# EAGLE design range_cape (EAGLE 7.1.0)

## Sheet 1 of 5
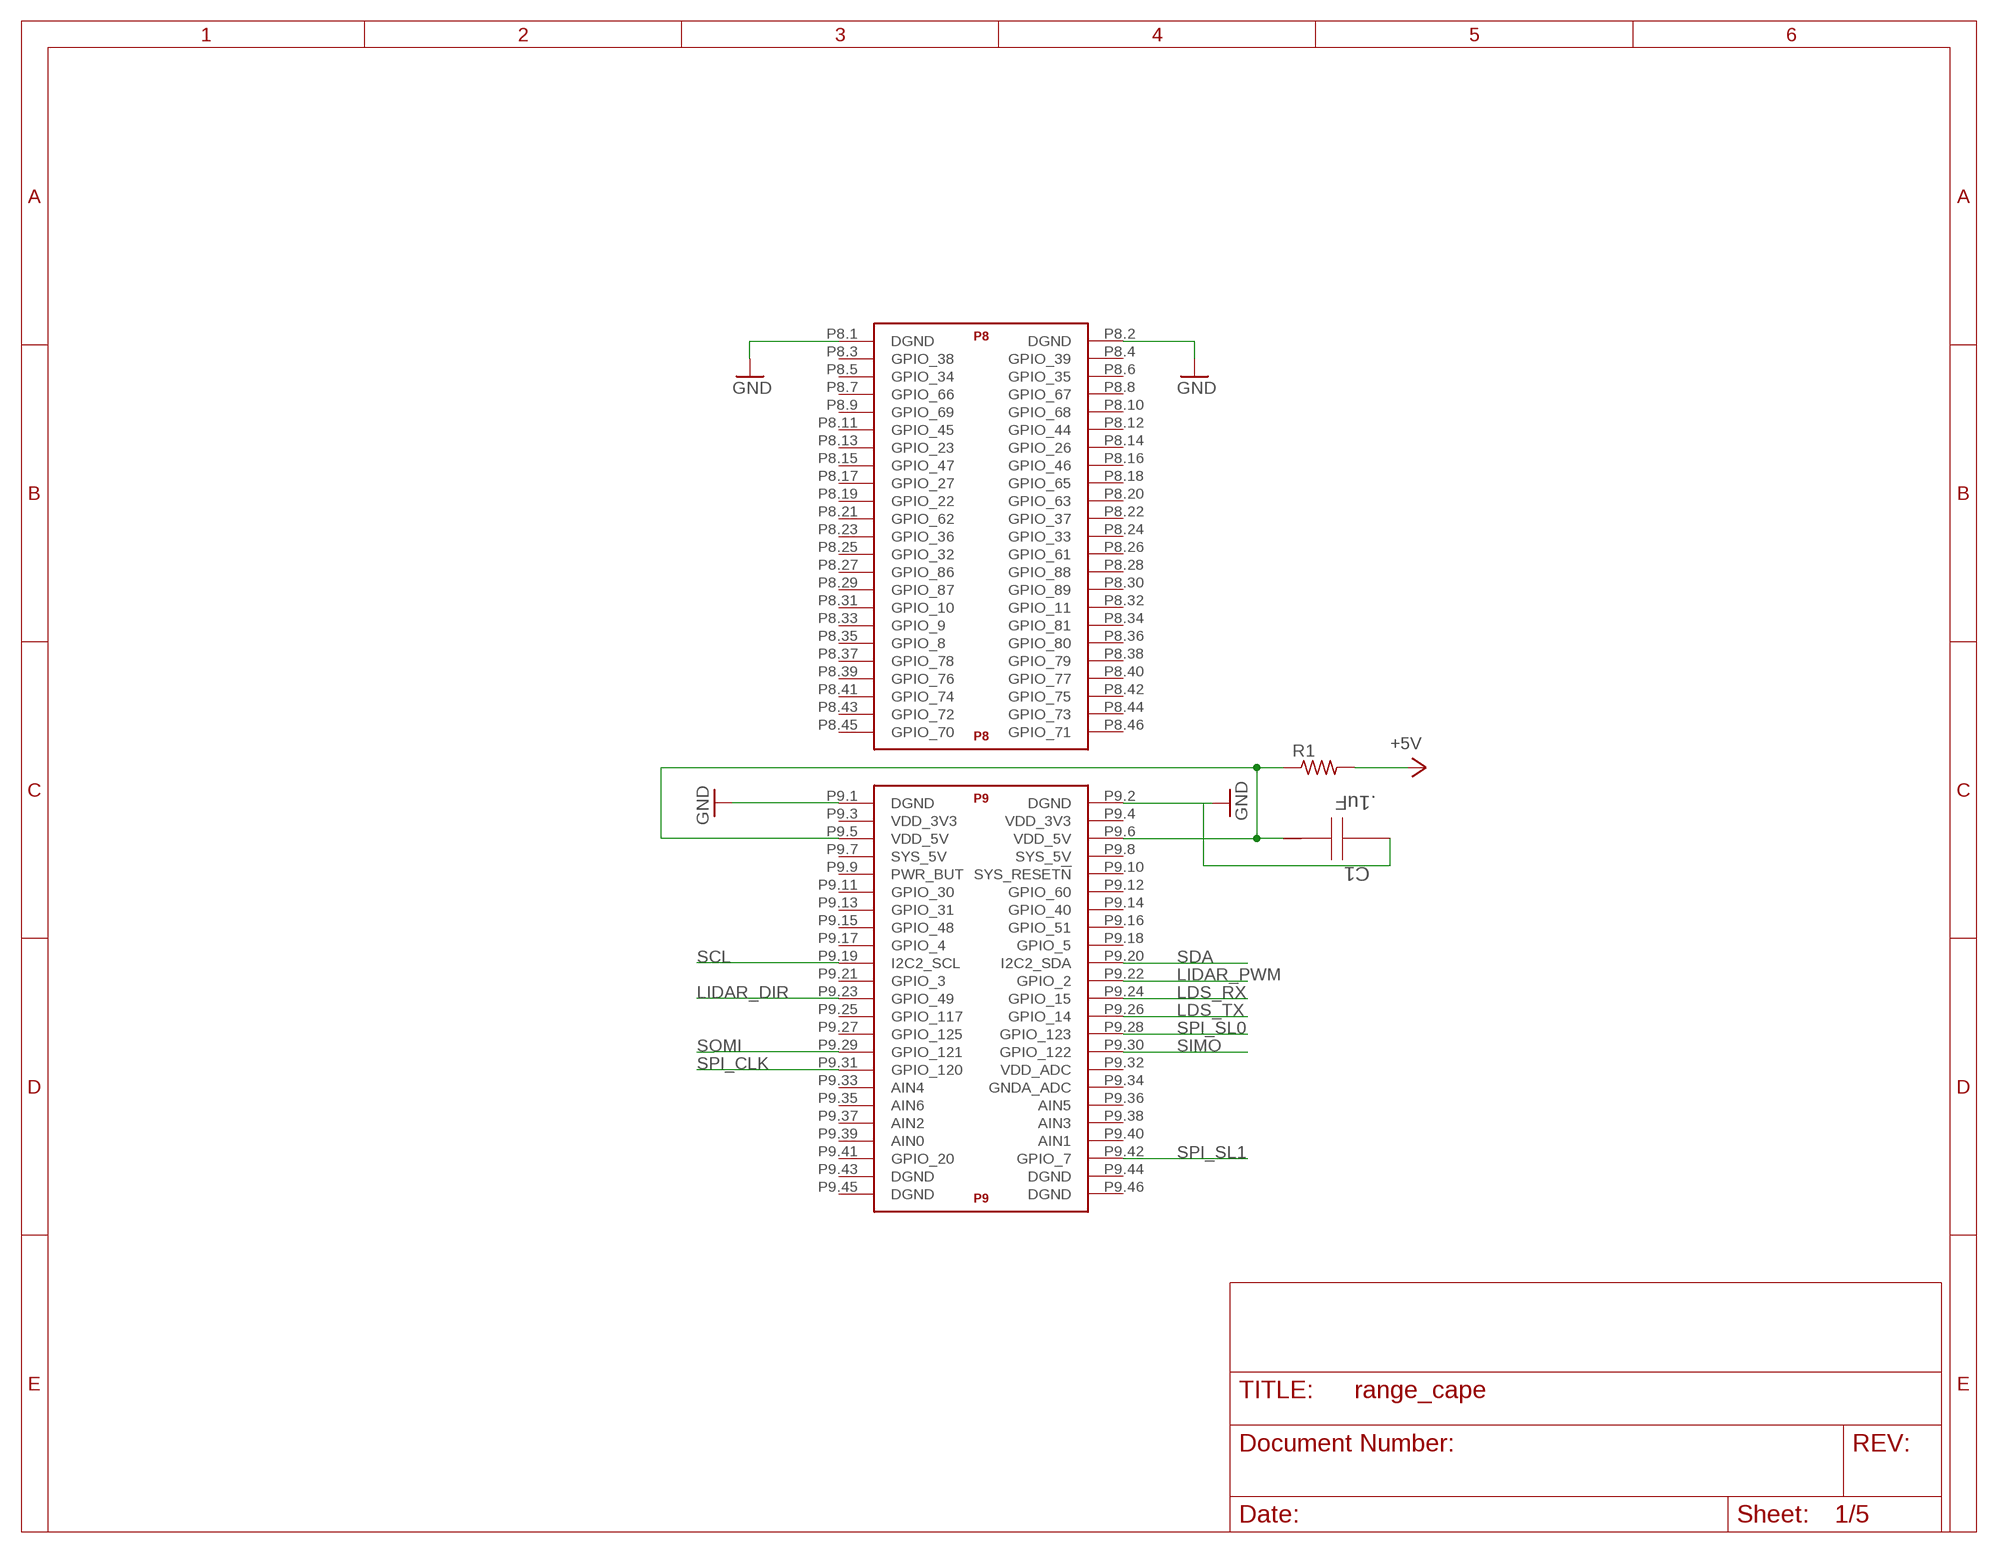
[diagram p0: schematic, sheet 1]

### Parts
C1  .1uF  C3216X5R1A106K  [1206]
R1  R-US_R1206  [R1206]
U$1  BEAGLE_BONE_BLACK_CAPE  [BEAGLE_BONE_BLACK_CAPE]

### Nets
+5V: R1.2 ; also sheet 2,3,4
GND: C1.2 U$1.P8.1(P8:DGND) U$1.P8.2(P8:DGND) U$1.P9.1(P9:DGND) U$1.P9.2(P9:DGND) ; also sheet 2,3,4,5
LDS_RX: U$1.P9.24(P9:GPIO_15) ; also sheet 3
LDS_TX: U$1.P9.26(P9:GPIO_14) ; also sheet 3
LIDAR_DIR: U$1.P9.23(P9:GPIO_49) ; also sheet 2
LIDAR_PWM: U$1.P9.22(P9:GPIO_2) ; also sheet 2
N$1: C1.1 R1.1 U$1.P9.5(P9:VDD_5V) U$1.P9.6(P9:VDD_5V)
SCL: U$1.P9.19(P9:I2C2_SCL) ; also sheet 3
SDA: U$1.P9.20(P9:I2C2_SDA) ; also sheet 3
SIMO: U$1.P9.30(P9:GPIO_122) ; also sheet 3
SOMI: U$1.P9.29(P9:GPIO_121) ; also sheet 3
SPI_CLK: U$1.P9.31(P9:GPIO_120) ; also sheet 5
SPI_SL0: U$1.P9.28(P9:GPIO_123) ; also sheet 3
SPI_SL1: U$1.P9.42(P9:GPIO_7) ; also sheet 3
Unconnected: U$1.P8.3(P8:GPIO_38) U$1.P8.4(P8:GPIO_39) U$1.P8.5(P8:GPIO_34) U$1.P8.6(P8:GPIO_35) U$1.P8.7(P8:GPIO_66) U$1.P8.8(P8:GPIO_67) U$1.P8.9(P8:GPIO_69) U$1.P8.10(P8:GPIO_68) U$1.P8.11(P8:GPIO_45) U$1.P8.12(P8:GPIO_44) U$1.P8.13(P8:GPIO_23) U$1.P8.14(P8:GPIO_26) U$1.P8.15(P8:GPIO_47) U$1.P8.16(P8:GPIO_46) U$1.P8.17(P8:GPIO_27) U$1.P8.18(P8:GPIO_65) U$1.P8.19(P8:GPIO_22) U$1.P8.20(P8:GPIO_63) U$1.P8.21(P8:GPIO_62) U$1.P8.22(P8:GPIO_37) U$1.P8.23(P8:GPIO_36) U$1.P8.24(P8:GPIO_33) U$1.P8.25(P8:GPIO_32) U$1.P8.26(P8:GPIO_61) U$1.P8.27(P8:GPIO_86) U$1.P8.28(P8:GPIO_88) U$1.P8.29(P8:GPIO_87) U$1.P8.30(P8:GPIO_89) U$1.P8.31(P8:GPIO_10) U$1.P8.32(P8:GPIO_11) U$1.P8.33(P8:GPIO_9) U$1.P8.34(P8:GPIO_81) U$1.P8.35(P8:GPIO_8) U$1.P8.36(P8:GPIO_80) U$1.P8.37(P8:GPIO_78) U$1.P8.38(P8:GPIO_79) U$1.P8.39(P8:GPIO_76) U$1.P8.40(P8:GPIO_77) U$1.P8.41(P8:GPIO_74) U$1.P8.42(P8:GPIO_75) U$1.P8.43(P8:GPIO_72) U$1.P8.44(P8:GPIO_73) U$1.P8.45(P8:GPIO_70) U$1.P8.46(P8:GPIO_71) U$1.P9.3(P9:VDD_3V3) U$1.P9.4(P9:VDD_3V3) U$1.P9.7(P9:SYS_5V) U$1.P9.8(P9:SYS_5V) U$1.P9.9(P9:PWR_BUT) U$1.P9.10(P9:SYS_RESET!N) U$1.P9.11(P9:GPIO_30) U$1.P9.12(P9:GPIO_60) U$1.P9.13(P9:GPIO_31) U$1.P9.14(P9:GPIO_40) U$1.P9.15(P9:GPIO_48) U$1.P9.16(P9:GPIO_51) U$1.P9.17(P9:GPIO_4) U$1.P9.18(P9:GPIO_5) U$1.P9.21(P9:GPIO_3) U$1.P9.25(P9:GPIO_117) U$1.P9.27(P9:GPIO_125) U$1.P9.32(P9:VDD_ADC) U$1.P9.33(P9:AIN4) U$1.P9.34(P9:GNDA_ADC) U$1.P9.35(P9:AIN6) U$1.P9.36(P9:AIN5) U$1.P9.37(P9:AIN2) U$1.P9.38(P9:AIN3) U$1.P9.39(P9:AIN0) U$1.P9.40(P9:AIN1) U$1.P9.41(P9:GPIO_20) U$1.P9.43(P9:DGND) U$1.P9.44(P9:DGND) U$1.P9.45(P9:DGND) U$1.P9.46(P9:DGND)

## Sheet 2 of 5
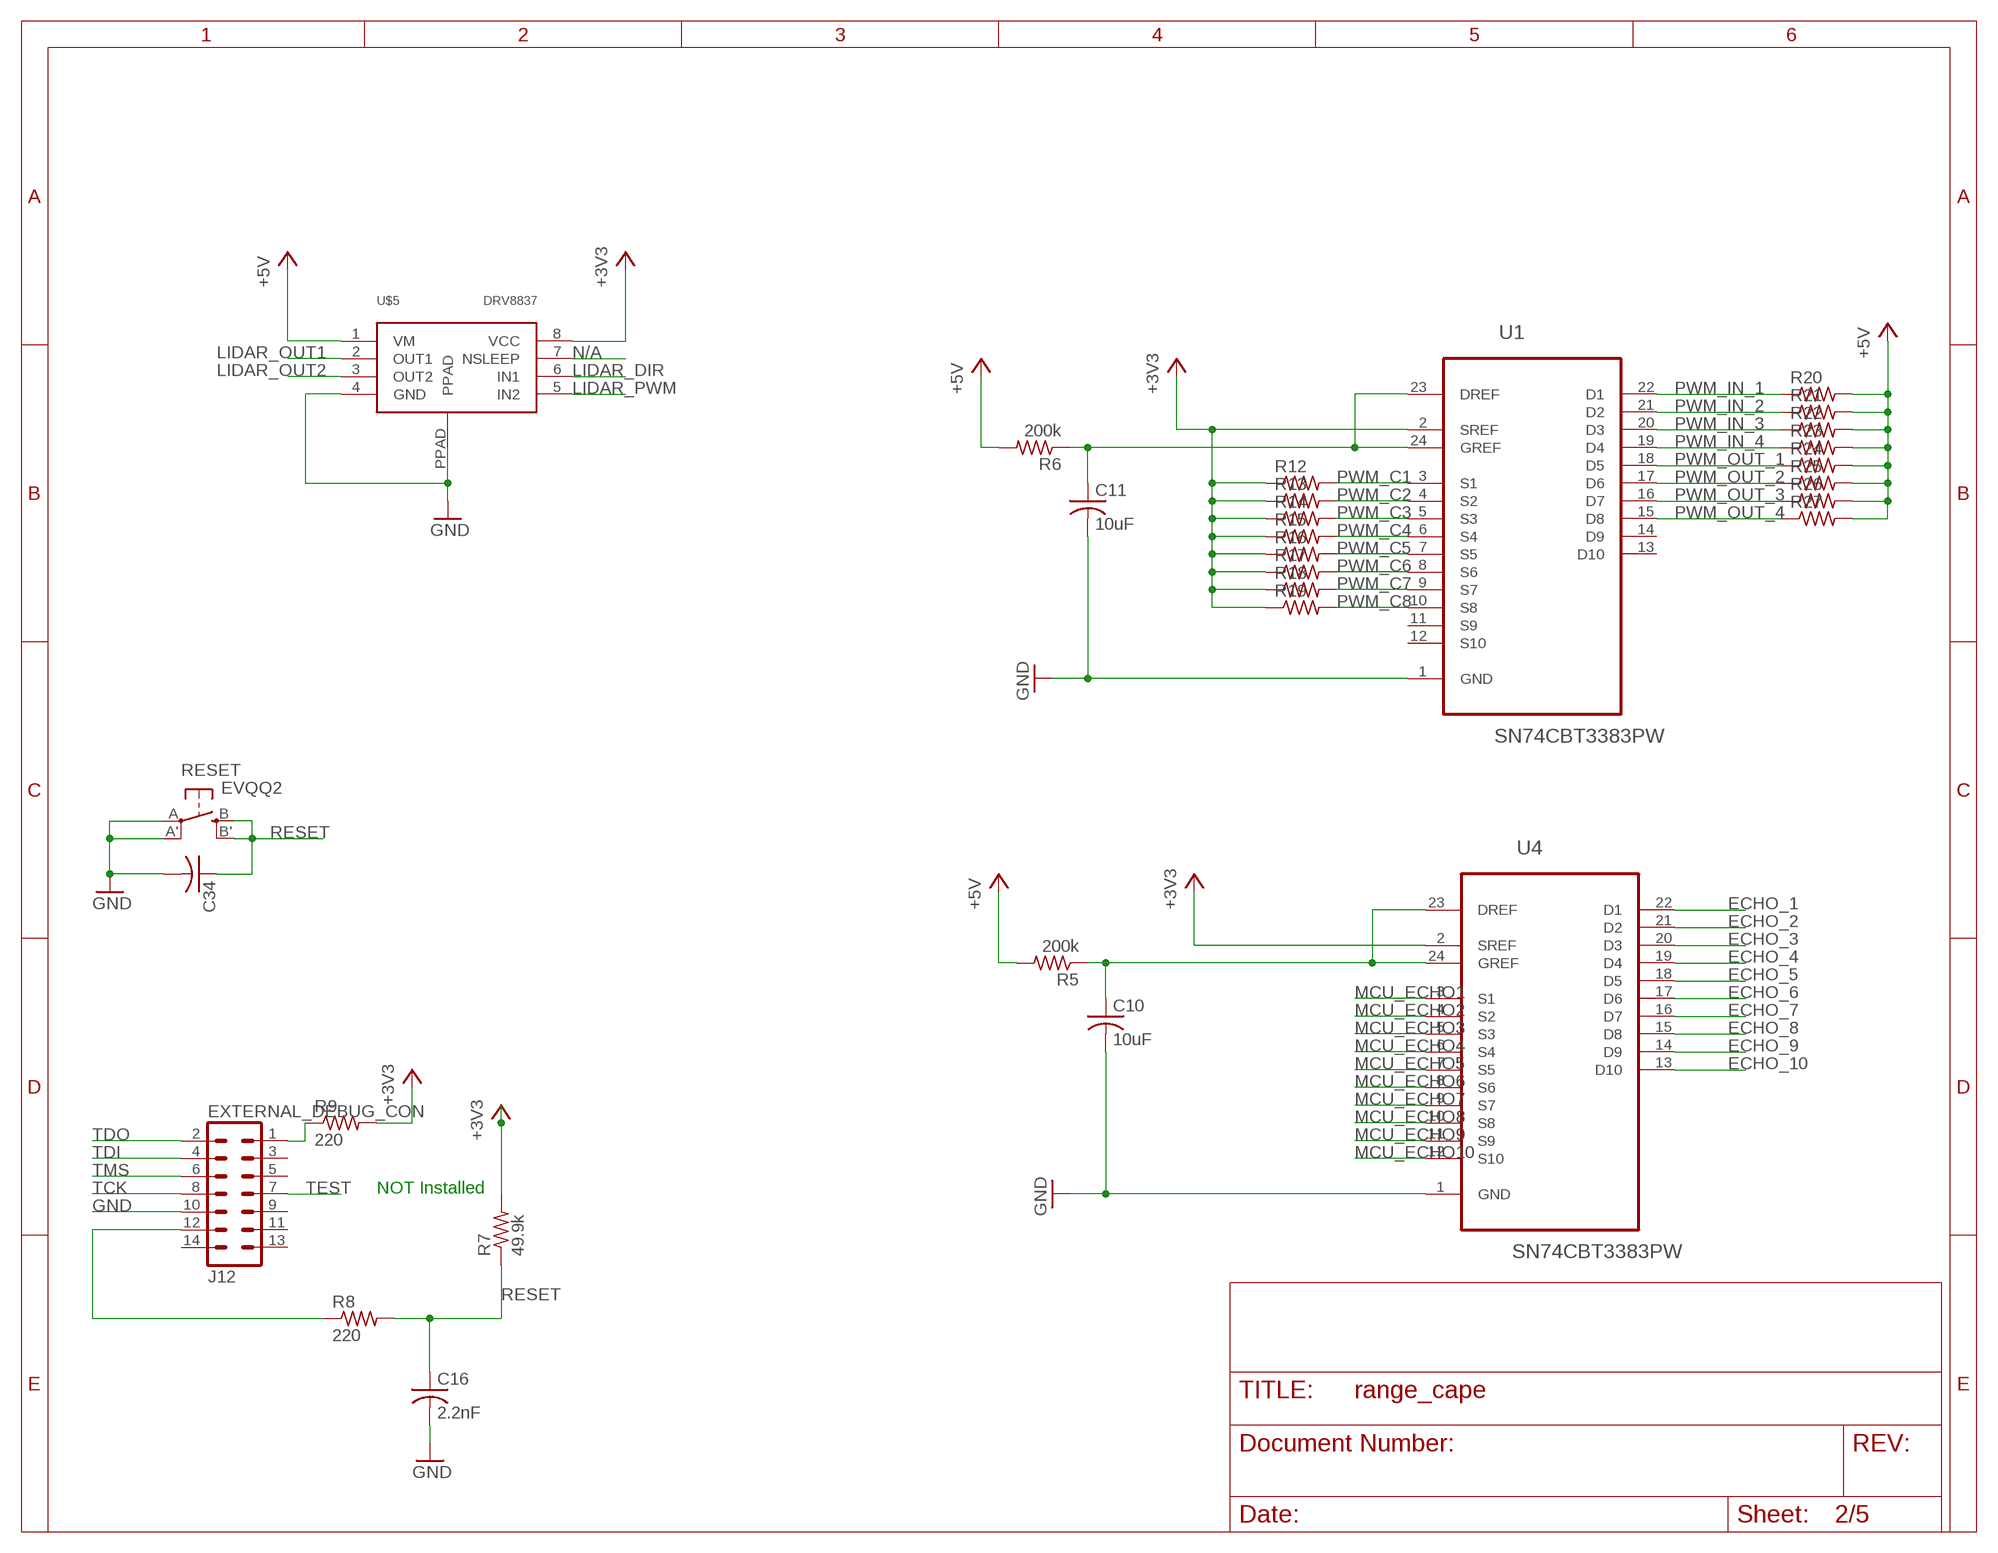
[diagram p1: schematic, sheet 2]

### Parts
C10  10uF  C-USC0805  [C0805]
C11  10uF  C-USC0805  [C0805]
C16  2.2nF  C-USC0603  [C0603]
C34  C-USC1206  [C1206]
J12  EXTERNAL_DEBUG_CON  [EXTERNAL_DEBUG]
R5  200k  R-US_R0603  [R0603]
R6  200k  R-US_R0603  [R0603]
R7  49.9k  R-US_R0603  [R0603]
R8  220  R-US_R0603  [R0603]
R9  220  R-US_R0603  [R0603]
R12  R-US_R0402  [R0402]
R13  R-US_R0402  [R0402]
R14  R-US_R0402  [R0402]
R15  R-US_R0402  [R0402]
R16  R-US_R0402  [R0402]
R17  R-US_R0402  [R0402]
R18  R-US_R0402  [R0402]
R19  R-US_R0402  [R0402]
R20  R-US_R0402  [R0402]
R21  R-US_R0402  [R0402]
R22  R-US_R0402  [R0402]
R23  R-US_R0402  [R0402]
R24  R-US_R0402  [R0402]
R25  R-US_R0402  [R0402]
R26  R-US_R0402  [R0402]
R27  R-US_R0402  [R0402]
RESET  EVQQ2  [EVQ-Q2]
U1  SN74CBT3383PW  [SOP65P640X120-24N]
U4  SN74CBT3383PW  [SOP65P640X120-24N]
U$5  DRV8837  [WSON-8]

### Nets
+3V3: R7.2 R9.2 R12.1 R13.1 R14.1 R15.1 R16.1 R17.1 R18.1 R19.1 U1.2(SREF) U4.2(SREF) U$5.8(VCC) ; also sheet 3,4,5
+5V: R5.2 R6.2 R20.2 R21.2 R22.2 R23.2 R24.2 R25.2 R26.2 R27.2 U$5.1(VM) ; also sheet 1,3,4
ECHO_1: U4.22(D1) ; also sheet 3
ECHO_2: U4.21(D2) ; also sheet 3
ECHO_3: U4.20(D3) ; also sheet 3
ECHO_4: U4.19(D4) ; also sheet 3
ECHO_5: U4.18(D5) ; also sheet 3
ECHO_6: U4.17(D6) ; also sheet 3
ECHO_7: U4.16(D7) ; also sheet 3
ECHO_8: U4.15(D8) ; also sheet 3
ECHO_9: U4.14(D9) ; also sheet 3
ECHO_10: U4.13(D10) ; also sheet 3
GND: C10.2 C11.2 C16.2 C34.2 J12.10 RESET.A'(P1) RESET.A(P) U1.1(GND) U4.1(GND) U$5.4(GND) U$5.PPAD ; also sheet 1,3,4,5
LIDAR_DIR: U$5.6(IN1) ; also sheet 1
LIDAR_OUT1: U$5.2(OUT1) ; also sheet 3
LIDAR_OUT2: U$5.3(OUT2) ; also sheet 3
LIDAR_PWM: U$5.5(IN2) ; also sheet 1
MCU_ECHO1: U4.3(S1) ; also sheet 5
MCU_ECHO2: U4.4(S2) ; also sheet 5
MCU_ECHO3: U4.5(S3) ; also sheet 5
MCU_ECHO4: U4.6(S4) ; also sheet 5
MCU_ECHO5: U4.7(S5) ; also sheet 5
MCU_ECHO6: U4.8(S6) ; also sheet 5
MCU_ECHO7: U4.9(S7) ; also sheet 5
MCU_ECHO8: U4.10(S8) ; also sheet 5
MCU_ECHO9: U4.11(S9) ; also sheet 5
MCU_ECHO10: U4.12(S10) ; also sheet 5
N$4: C11.1 R6.1 U1.23(DREF) U1.24(GREF)
N$8: J12.12 R8.1
N$9: J12.1 R9.1
N$12: C10.1 R5.1 U4.23(DREF) U4.24(GREF)
N/A: U$5.7(NSLEEP)
PWM_C1: R12.2 U1.3(S1) ; also sheet 5
PWM_C2: R13.2 U1.4(S2) ; also sheet 5
PWM_C3: R14.2 U1.5(S3) ; also sheet 5
PWM_C4: R15.2 U1.6(S4) ; also sheet 5
PWM_C5: R16.2 U1.7(S5) ; also sheet 5
PWM_C6: R17.2 U1.8(S6) ; also sheet 5
PWM_C7: R18.2 U1.9(S7) ; also sheet 5
PWM_C8: R19.2 U1.10(S8) ; also sheet 5
PWM_IN_1: R20.1 U1.22(D1) ; also sheet 3
PWM_IN_2: R21.1 U1.21(D2) ; also sheet 3
PWM_IN_3: R22.1 U1.20(D3) ; also sheet 3
PWM_IN_4: R23.1 U1.19(D4) ; also sheet 3
PWM_OUT_1: R24.1 U1.18(D5) ; also sheet 3
PWM_OUT_2: R25.1 U1.17(D6) ; also sheet 3
PWM_OUT_3: R26.1 U1.16(D7) ; also sheet 3
PWM_OUT_4: R27.1 U1.15(D8) ; also sheet 3
RESET: C16.1 C34.1 R7.1 R8.2 RESET.B'(S1) RESET.B(S) ; also sheet 5
TCK: J12.8 ; also sheet 5
TDI: J12.4 ; also sheet 5
TDO: J12.2 ; also sheet 5
TEST: J12.7 ; also sheet 5
TMS: J12.6 ; also sheet 5
Unconnected: J12.3 J12.5 J12.9 J12.11 J12.13 J12.14 U1.11(S9) U1.12(S10) U1.13(D10) U1.14(D9)

### Notes on the sheet
- NOT Installed

## Sheet 3 of 5
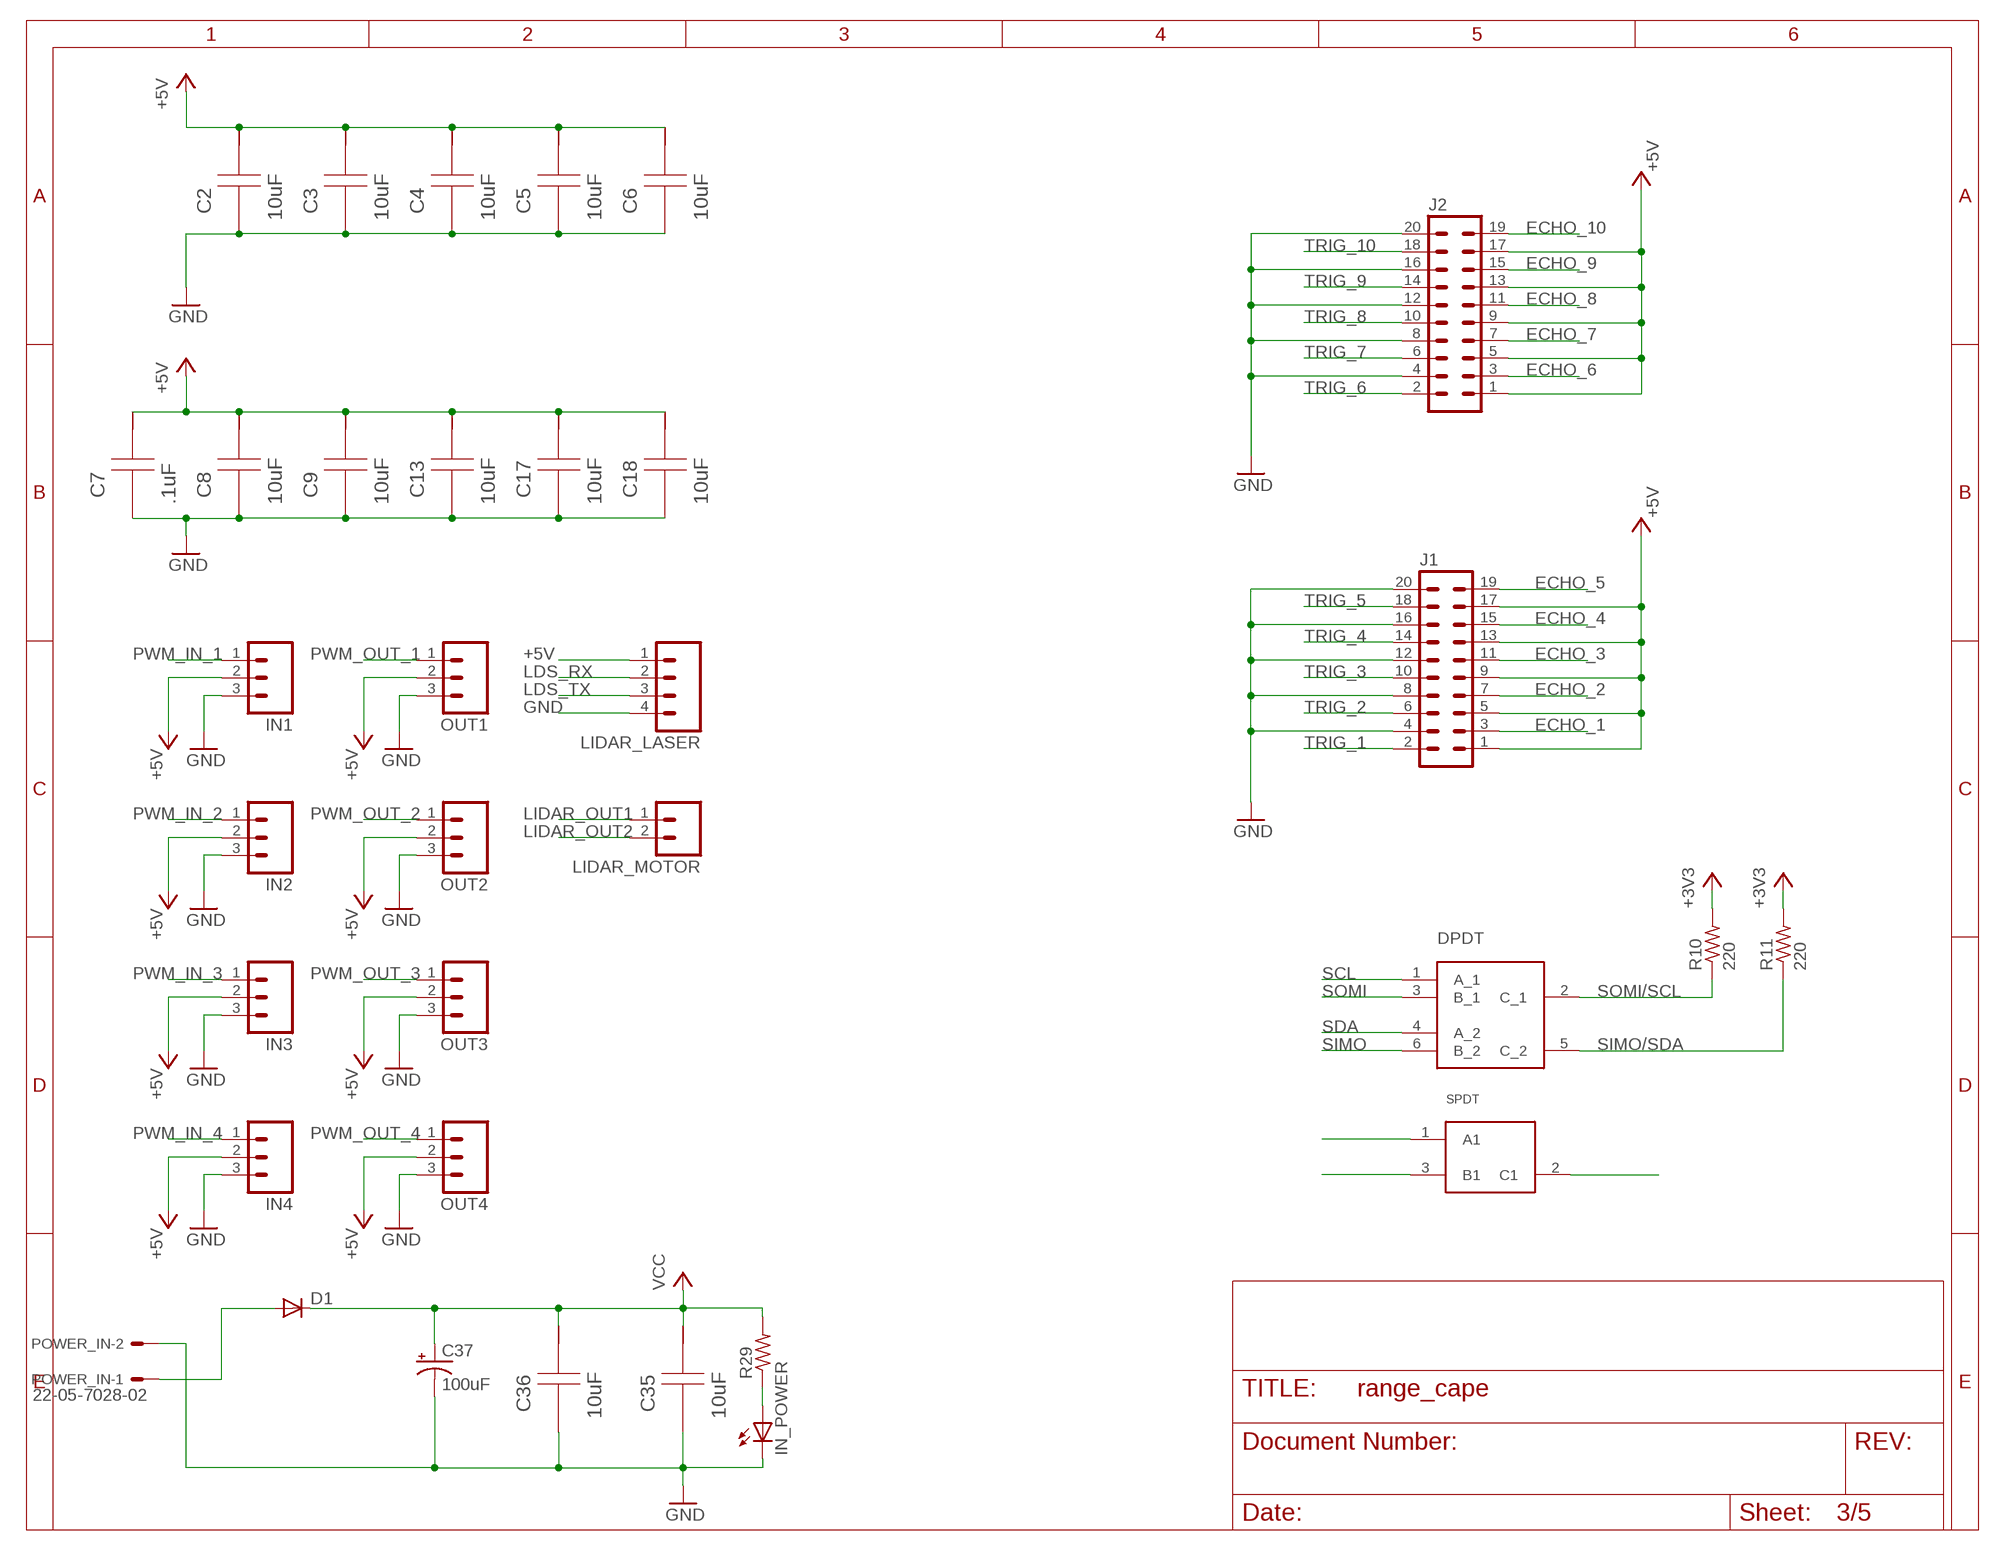
[diagram p2: schematic, sheet 3]

### Parts
C2  10uF  C3216X5R1A106K  [1206]
C3  10uF  C3216X5R1A106K  [1206]
C4  10uF  C3216X5R1A106K  [1206]
C5  10uF  C3216X5R1A106K  [1206]
C6  10uF  C3216X5R1A106K  [1206]
C7  .1uF  C3216X5R1A106K  [1206]
C8  10uF  C3216X5R1A106K  [1206]
C9  10uF  C3216X5R1A106K  [1206]
C13  10uF  C3216X5R1A106K  [1206]
C17  10uF  C3216X5R1A106K  [1206]
C18  10uF  C3216X5R1A106K  [1206]
C35  10uF  C3216X5R1A106K  [1206]
C36  10uF  C3216X5R1A106K  [1206]
C37  100uF  100UF-10V-10%(TANT)  [EIA7343]
D1  DIODE-DO-214AC  [DO-214AC]
IN1  M03LOCK  [1X03_LOCK]
IN2  M03LOCK  [1X03_LOCK]
IN3  M03LOCK  [1X03_LOCK]
IN4  M03LOCK  [1X03_LOCK]
IN_POWER  LED_ESML0603  [LED_SML0603]
J1  MA10-2  [MA10-2]
J2  MA10-2  [MA10-2]
LIDAR_LASER  M04JST-PTH-VERT  [JST-4-PTH-VERT]
LIDAR_MOTOR  M02JST-PTH-VERT  [JST-2-PTH-VERT]
OUT1  M03LOCK  [1X03_LOCK]
OUT2  M03LOCK  [1X03_LOCK]
OUT3  M03LOCK  [1X03_LOCK]
OUT4  M03LOCK  [1X03_LOCK]
POWER_IN  22-05-7028-02  [7395-02]
R10  220  R-US_R0402  [R0402]
R11  220  R-US_R0402  [R0402]
R29  R-US_R0603  [R0603]
SPDT  SPDT_SWITCH  [SPDT]
U$4  DPDT_I2C_SPI  [DPDT]

### Nets
+3V3: R10.2 R11.2 ; also sheet 2,4,5
+5V: C2.1 C3.1 C4.1 C5.1 C6.1 C7.1 C8.1 C9.1 C13.1 C17.1 C18.1 IN1.2 IN2.2 IN3.2 IN4.2 J1.1 J1.5 J1.9 J1.13 J1.17 J2.1 J2.5 J2.9 J2.13 J2.17 LIDAR_LASER.1 OUT1.2 OUT2.2 OUT3.2 OUT4.2 ; also sheet 1,2,4
ECHO_1: J1.3 ; also sheet 2
ECHO_2: J1.7 ; also sheet 2
ECHO_3: J1.11 ; also sheet 2
ECHO_4: J1.15 ; also sheet 2
ECHO_5: J1.19 ; also sheet 2
ECHO_6: J2.3 ; also sheet 2
ECHO_7: J2.7 ; also sheet 2
ECHO_8: J2.11 ; also sheet 2
ECHO_9: J2.15 ; also sheet 2
ECHO_10: J2.19 ; also sheet 2
GND: C2.2 C3.2 C4.2 C5.2 C6.2 C7.2 C8.2 C9.2 C13.2 C17.2 C18.2 C35.2 C36.2 C37.C(-) IN1.3 IN2.3 IN3.3 IN4.3 IN_POWER.C J1.4 J1.8 J1.12 J1.16 J1.20 J2.4 J2.8 J2.12 J2.16 J2.20 LIDAR_LASER.4 OUT1.3 OUT2.3 OUT3.3 OUT4.3 POWER_IN.2 ; also sheet 1,2,4,5
LDS_RX: LIDAR_LASER.2 ; also sheet 1
LDS_TX: LIDAR_LASER.3 ; also sheet 1
LIDAR_OUT1: LIDAR_MOTOR.1 ; also sheet 2
LIDAR_OUT2: LIDAR_MOTOR.2 ; also sheet 2
N$3: D1.A POWER_IN.1
N$11: IN_POWER.A R29.1
PWM_IN_1: IN1.1 ; also sheet 2
PWM_IN_2: IN2.1 ; also sheet 2
PWM_IN_3: IN3.1 ; also sheet 2
PWM_IN_4: IN4.1 ; also sheet 2
PWM_OUT_1: OUT1.1 ; also sheet 2
PWM_OUT_2: OUT2.1 ; also sheet 2
PWM_OUT_3: OUT3.1 ; also sheet 2
PWM_OUT_4: OUT4.1 ; also sheet 2
SCL: U$4.1(A_1) ; also sheet 1
SDA: U$4.4(A_2) ; also sheet 1
SIMO: U$4.6(B_2) ; also sheet 1
SIMO/SDA: R11.1 U$4.5(C_2) ; also sheet 5
SOMI: U$4.3(B_1) ; also sheet 1
SOMI/SCL: R10.1 U$4.2(C_1) ; also sheet 5
SPI_SL: SPDT.2(C1) ; also sheet 5
SPI_SL0: SPDT.1(A1) ; also sheet 1
SPI_SL1: SPDT.3(B1) ; also sheet 1
TRIG_1: J1.2 ; also sheet 5
TRIG_2: J1.6 ; also sheet 5
TRIG_3: J1.10 ; also sheet 5
TRIG_4: J1.14 ; also sheet 5
TRIG_5: J1.18 ; also sheet 5
TRIG_6: J2.2 ; also sheet 5
TRIG_7: J2.6 ; also sheet 5
TRIG_8: J2.10 ; also sheet 5
TRIG_9: J2.14 ; also sheet 5
TRIG_10: J2.18 ; also sheet 5
VCC: C35.1 C36.1 C37.A(+) D1.C R29.2 ; also sheet 4

## Sheet 4 of 5
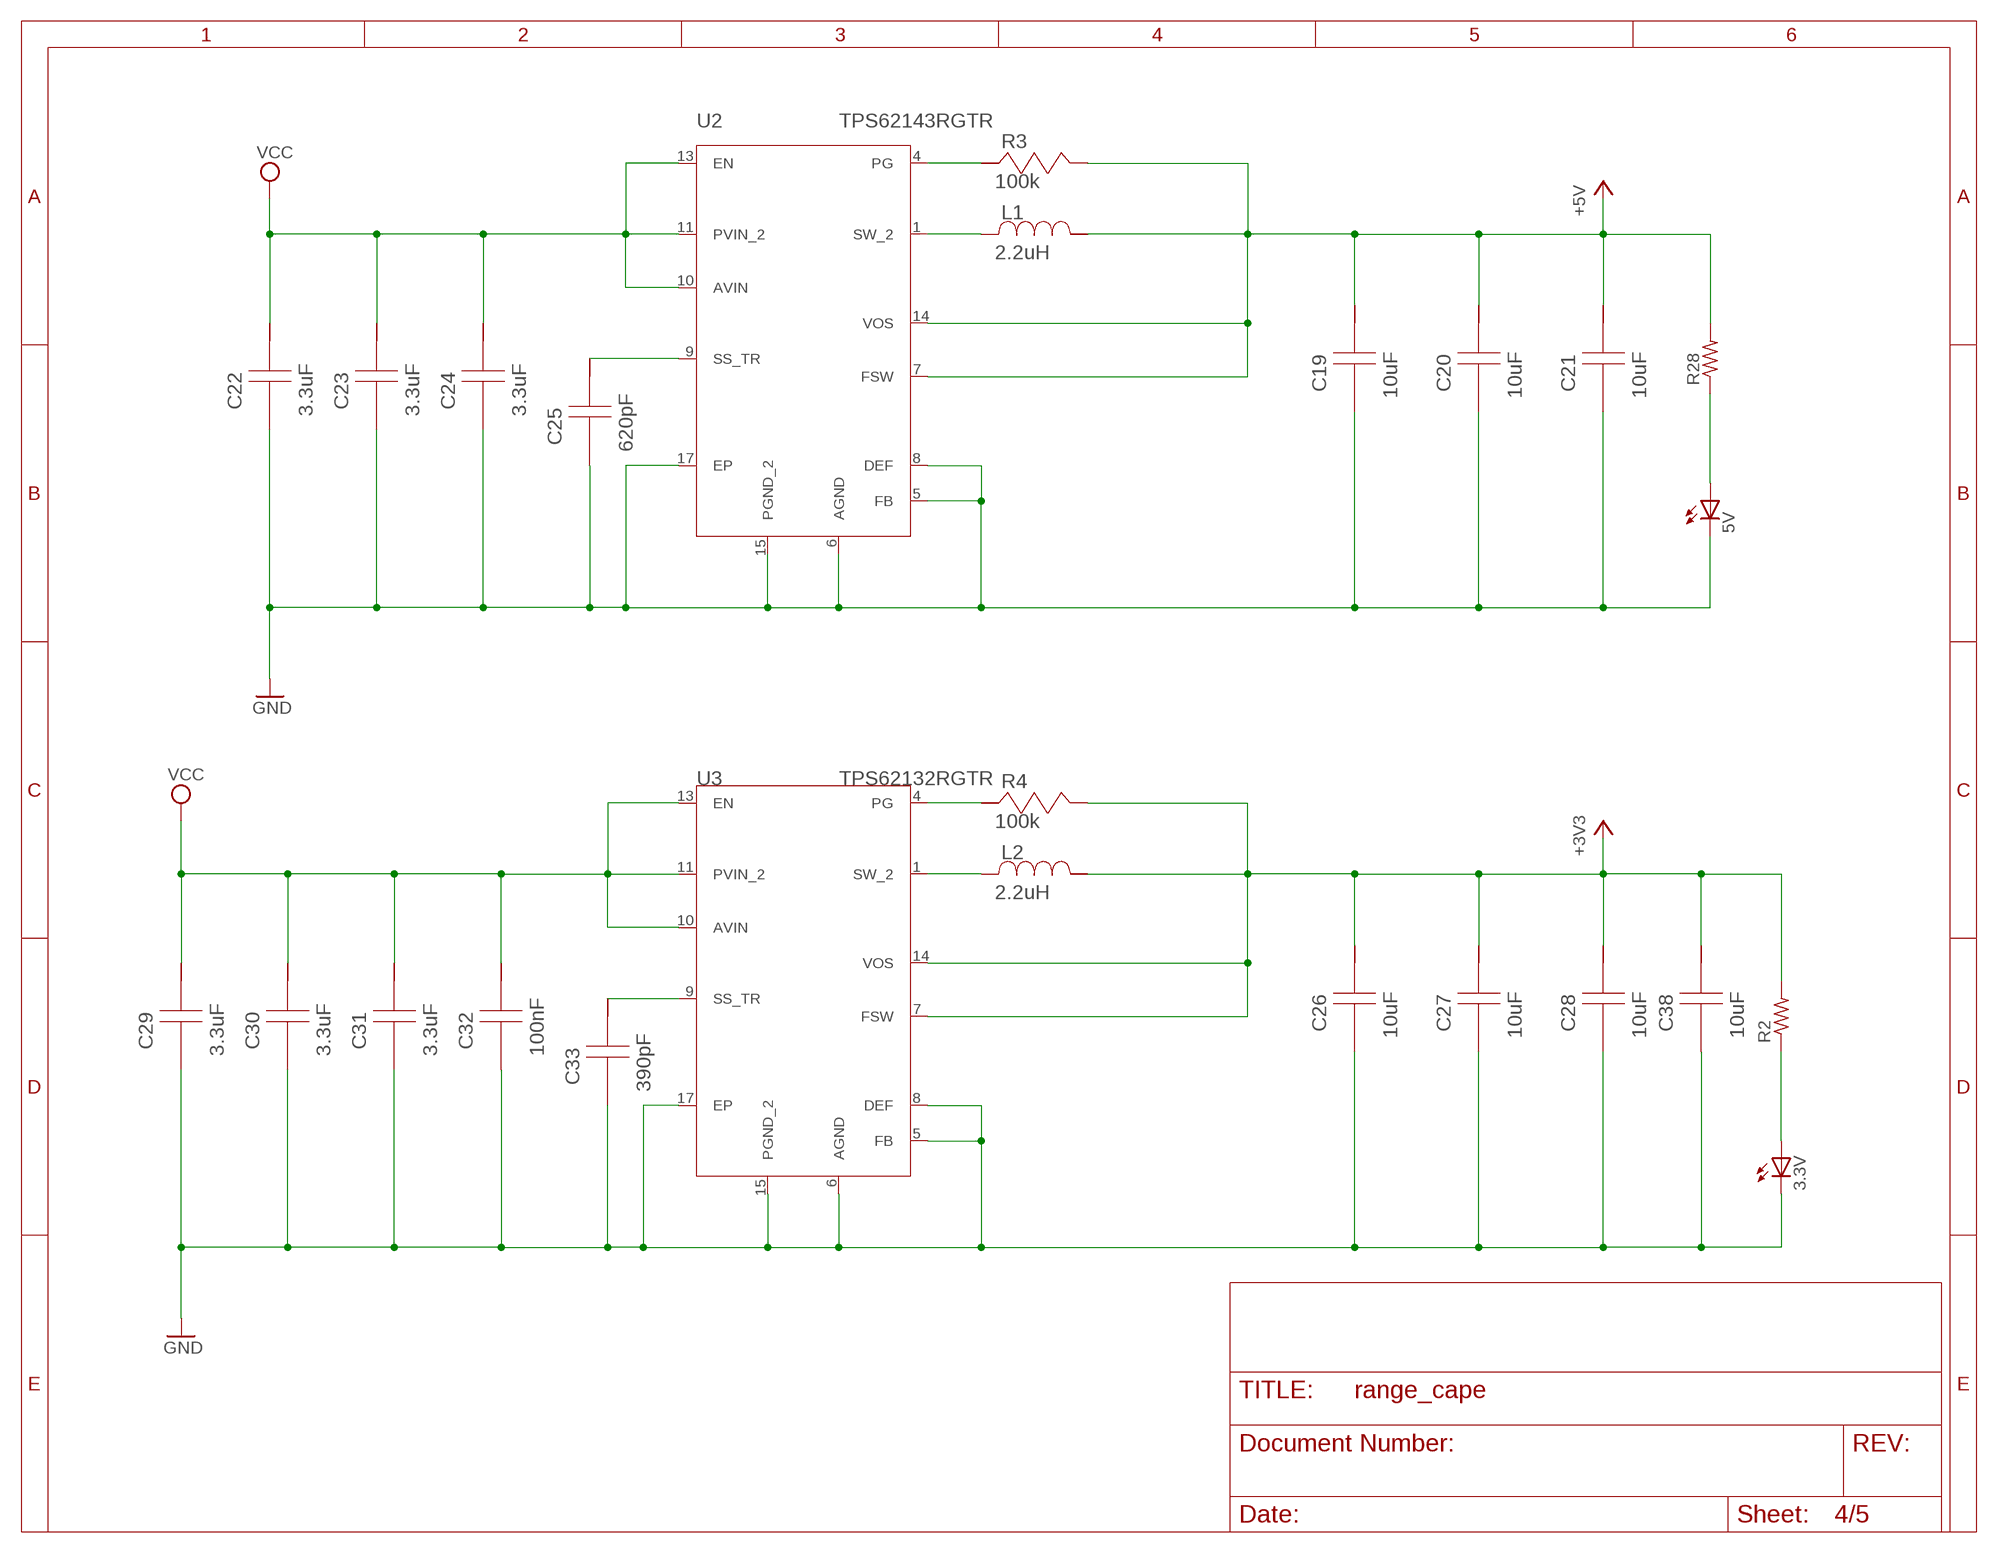
[diagram p3: schematic, sheet 4]

### Parts
3.3V  LED_ESML0603  [LED_SML0603]
5V  LED_ESML0603  [LED_SML0603]
C19  10uF  C3216X5R1A106K  [1206]
C20  10uF  C3216X5R1A106K  [1206]
C21  10uF  C3216X5R1A106K  [1206]
C22  3.3uF  C3216X7R1E335K  [C3216X7R1E335K]
C23  3.3uF  C3216X7R1E335K  [C3216X7R1E335K]
C24  3.3uF  C3216X7R1E335K  [C3216X7R1E335K]
C25  620pF  GRM1555C1E621JA01D  [0402]
C26  10uF  C3216X5R1A106K  [1206]
C27  10uF  C3216X5R1A106K  [1206]
C28  10uF  C3216X5R1A106K  [1206]
C29  3.3uF  C3216X7R1E335K  [C3216X7R1E335K]
C30  3.3uF  C3216X7R1E335K  [C3216X7R1E335K]
C31  3.3uF  C3216X7R1E335K  [C3216X7R1E335K]
C32  100nF  C0603C104K3RACTU  [0603]
C33  390pF  08055C391KAT2A  [0805]
C38  10uF  C3216X5R1A106K  [1206]
L1  2.2uH  IHLP1212BZER2R2M11  [IHLP-1212BZ]
L2  2.2uH  IHLP1212BZER2R2M11  [IHLP-1212BZ]
R2  R-US_R0603  [R0603]
R3  100k  CRCW0402100KFKED  [CRCW0402100KFKED]
R4  100k  CRCW0402100KFKED  [CRCW0402100KFKED]
R28  R-US_R0603  [R0603]
U2  TPS62143RGTR  [S-PVQFN-N16]
U3  TPS62132RGTR  [S-PVQFN-N16]

### Nets
+3V3: C26.1 C27.1 C28.1 C38.1 L2.2 R2.2 R4.1 U3.7(FSW) U3.14(VOS) ; also sheet 2,3,5
+5V: C19.1 C20.1 C21.1 L1.2 R3.1 R28.2 U2.7(FSW) U2.14(VOS) ; also sheet 1,2,3
GND: 3.3V.C 5V.C C19.2 C20.2 C21.2 C22.2 C23.2 C24.2 C25.2 C26.2 C27.2 C28.2 C29.2 C30.2 C31.2 C32.2 C33.2 C38.2 U2.5(FB) U2.6(AGND) U2.8(DEF) U2.15(PGND_2) U2.17(EP) U3.5(FB) U3.6(AGND) U3.8(DEF) U3.15(PGND_2) U3.17(EP) ; also sheet 1,2,3,5
N$2: L2.1 U3.1(SW_2)
N$5: L1.1 U2.1(SW_2)
N$6: 3.3V.A R2.1
N$7: C25.1 U2.9(SS_TR)
N$10: 5V.A R28.1
N$14: R3.2 U2.4(PG)
N$15: R4.2 U3.4(PG)
N$20: C33.1 U3.9(SS_TR)
VCC: C22.1 C23.1 C24.1 C29.1 C30.1 C31.1 C32.1 U2.10(AVIN) U2.11(PVIN_2) U2.13(EN) U3.10(AVIN) U3.11(PVIN_2) U3.13(EN) ; also sheet 3

## Sheet 5 of 5
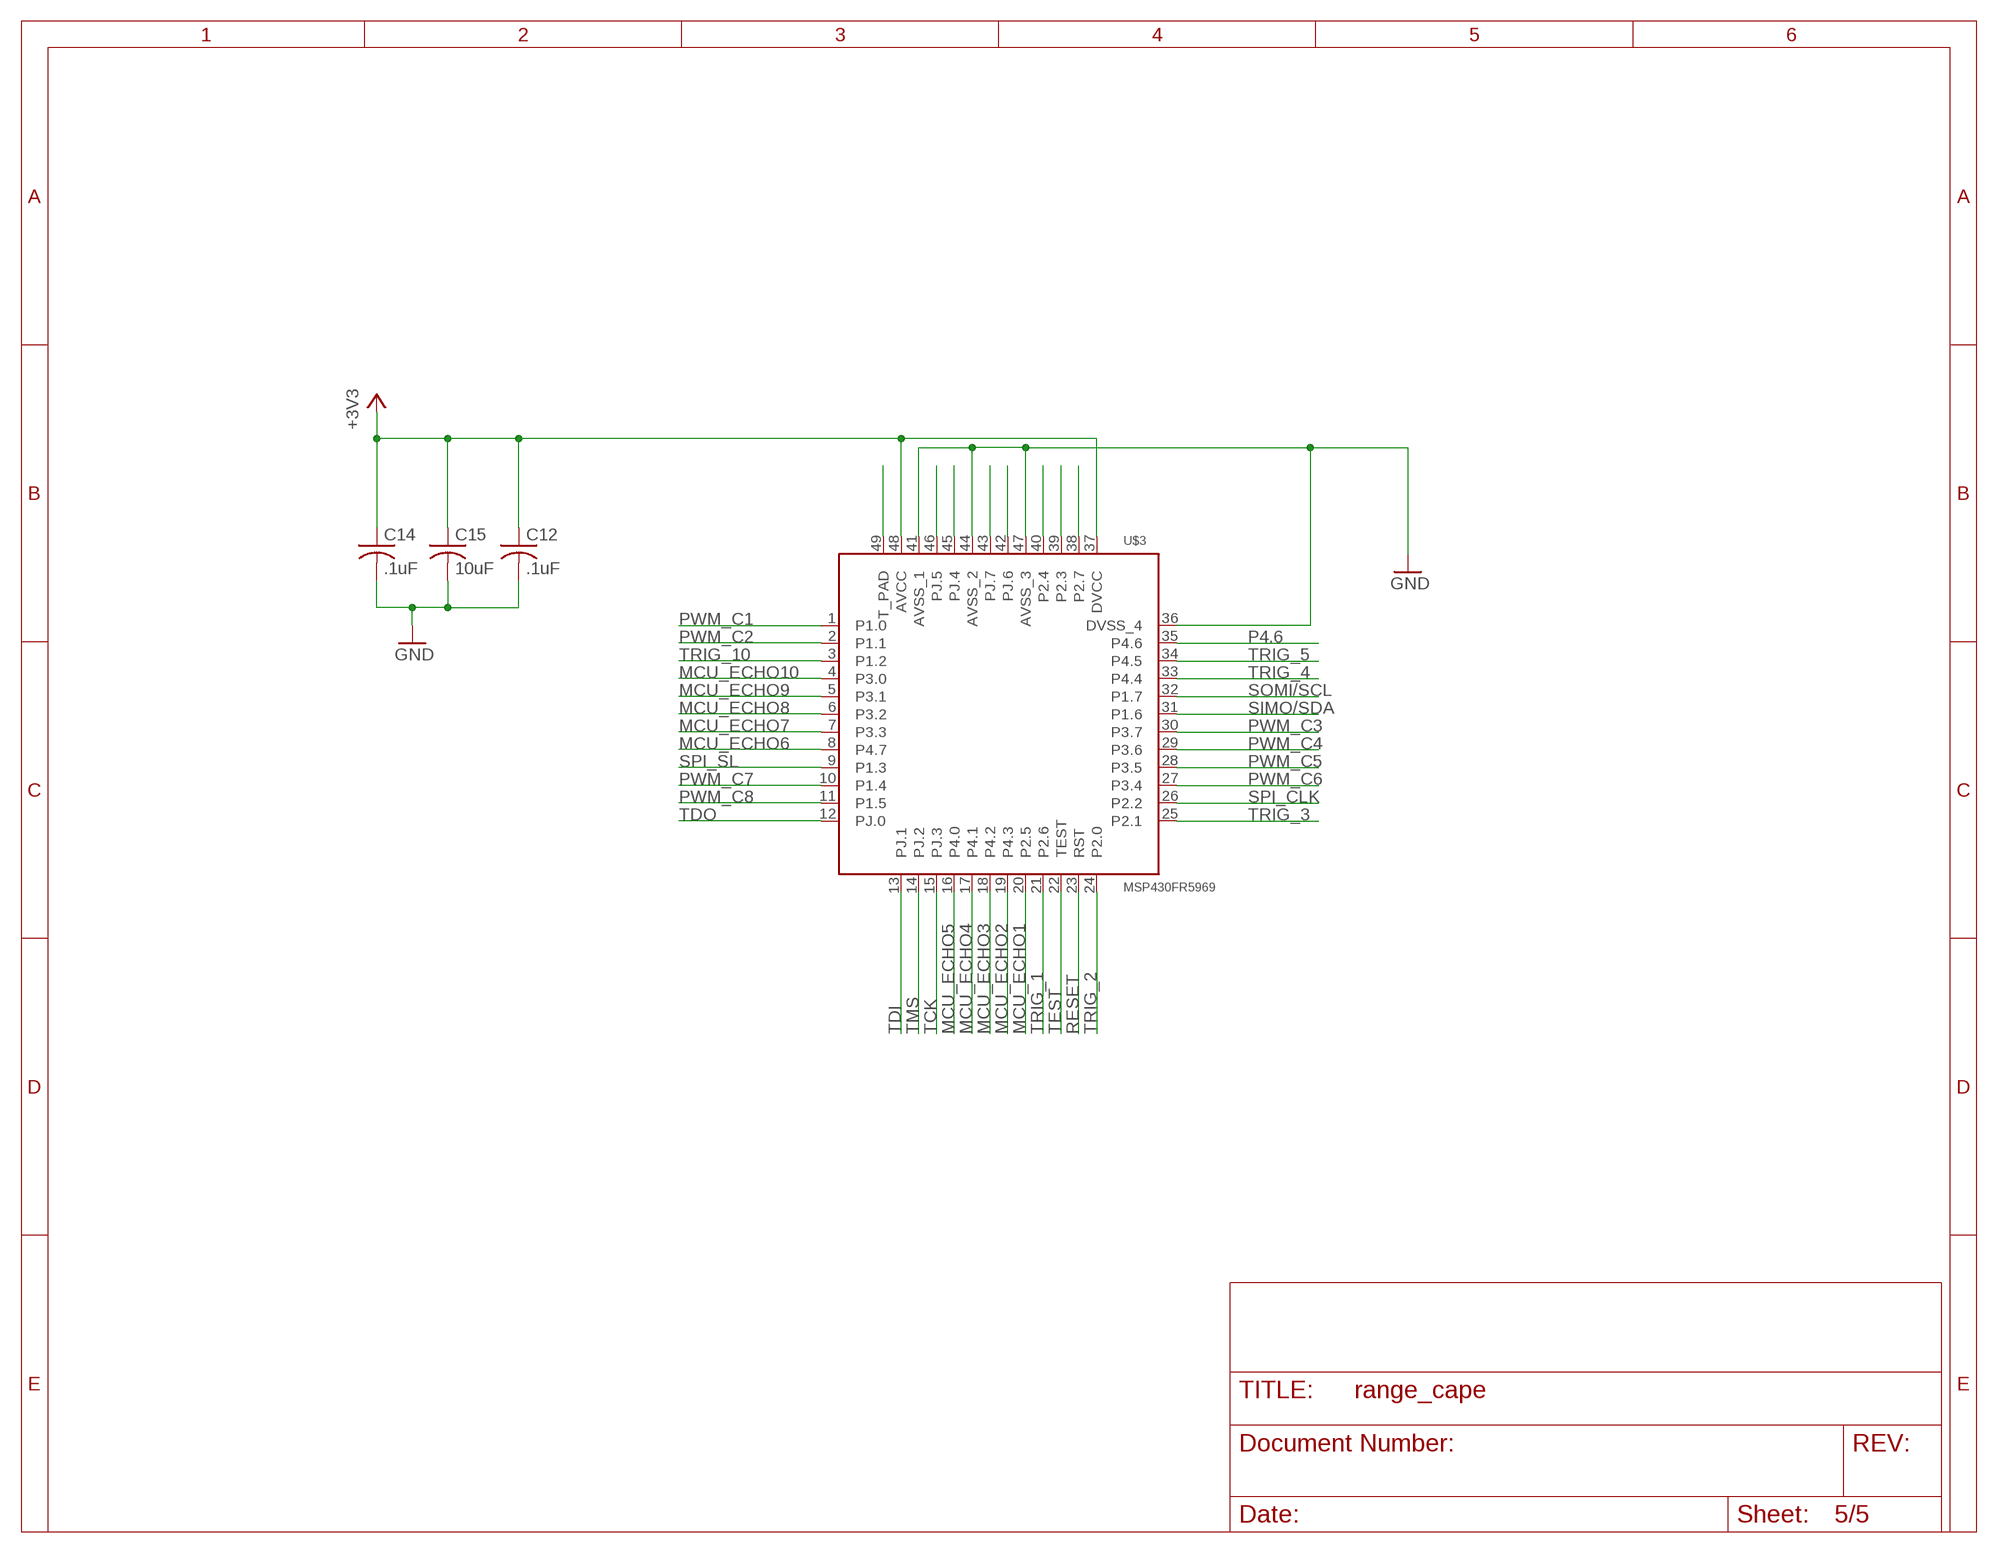
[diagram p4: schematic, sheet 5]

### Parts
C12  .1uF  C-USC0805  [C0805]
C14  .1uF  C-USC0805  [C0805]
C15  10uF  C-USC0805  [C0805]
U$3  MSP430FR5969  [QFN50P700X700X100-49N]

### Nets
+3V3: C12.1 C14.1 C15.1 U$3.37(DVCC) U$3.48(AVCC) ; also sheet 2,3,4
GND: C12.2 C14.2 C15.2 U$3.36(DVSS_4) U$3.41(AVSS_1) U$3.44(AVSS_2) U$3.47(AVSS_3) ; also sheet 1,2,3,4
MCU_ECHO1: U$3.20(P2.5) ; also sheet 2
MCU_ECHO2: U$3.19(P4.3) ; also sheet 2
MCU_ECHO3: U$3.18(P4.2) ; also sheet 2
MCU_ECHO4: U$3.17(P4.1) ; also sheet 2
MCU_ECHO5: U$3.16(P4.0) ; also sheet 2
MCU_ECHO6: U$3.8(P4.7) ; also sheet 2
MCU_ECHO7: U$3.7(P3.3) ; also sheet 2
MCU_ECHO8: U$3.6(P3.2) ; also sheet 2
MCU_ECHO9: U$3.5(P3.1) ; also sheet 2
MCU_ECHO10: U$3.4(P3.0) ; also sheet 2
P2.3: U$3.39(P2.3)
P2.4: U$3.40(P2.4)
P2.7: U$3.38(P2.7)
P4.6: U$3.35(P4.6)
PWM_C1: U$3.1(P1.0) ; also sheet 2
PWM_C2: U$3.2(P1.1) ; also sheet 2
PWM_C3: U$3.30(P3.7) ; also sheet 2
PWM_C4: U$3.29(P3.6) ; also sheet 2
PWM_C5: U$3.28(P3.5) ; also sheet 2
PWM_C6: U$3.27(P3.4) ; also sheet 2
PWM_C7: U$3.10(P1.4) ; also sheet 2
PWM_C8: U$3.11(P1.5) ; also sheet 2
RESET: U$3.23(RST) ; also sheet 2
SIMO/SDA: U$3.31(P1.6) ; also sheet 3
SOMI/SCL: U$3.32(P1.7) ; also sheet 3
SPI_CLK: U$3.26(P2.2) ; also sheet 1
SPI_SL: U$3.9(P1.3) ; also sheet 3
T_PAD: U$3.49(T_PAD)
TCK: U$3.15(PJ.3) ; also sheet 2
TDI: U$3.13(PJ.1) ; also sheet 2
TDO: U$3.12(PJ.0) ; also sheet 2
TEST: U$3.22(TEST) ; also sheet 2
TMS: U$3.14(PJ.2) ; also sheet 2
TRIG_1: U$3.21(P2.6) ; also sheet 3
TRIG_2: U$3.24(P2.0) ; also sheet 3
TRIG_3: U$3.25(P2.1) ; also sheet 3
TRIG_4: U$3.33(P4.4) ; also sheet 3
TRIG_5: U$3.34(P4.5) ; also sheet 3
TRIG_6: U$3.42(PJ.6) ; also sheet 3
TRIG_7: U$3.43(PJ.7) ; also sheet 3
TRIG_8: U$3.45(PJ.4) ; also sheet 3
TRIG_9: U$3.46(PJ.5) ; also sheet 3
TRIG_10: U$3.3(P1.2) ; also sheet 3

## Library data of the parts
3.3V 5V IN_POWER = eagle-ltspice:LED_E: LED Source: http://www.osram.convergy.de Source: www.luxeon.com Source: www.kingbright.com; SPICEMODEL: NONE; SPICEPREFIX: D; SPICETYPE: diode
C1-C9 C13 C17 C18 C35 C36 = 3-3_fixed:C3216X5R1A106K; CAP: 1.0E-5; DATASHEETURL: http://www.tdk.co.jp/tefe02/e3999%5Fc.pdf; ESR: 0.00306; IRMS: 0.0; MANUFACTURER_PART_NUMBER: C3216X5R1A106K; VDC: 10.0; VENDOR: TDK
C10-C12 C14-C16 C34 = rcl:C-US: CAPACITOR, American symbol
C19-C21 C26-C28 C38 = 5v_fixed:C3216X5R1A106K; CAP: 1.0E-5; DATASHEETURL: http://www.tdk.co.jp/tefe02/e3999%5Fc.pdf; ESR: 0.00306; IRMS: 0.0; MANUFACTURER_PART_NUMBER: C3216X5R1A106K; VDC: 10.0; VENDOR: TDK
C22-C24 C29-C31 = 5v_fixed:C3216X7R1E335K; CAP: 3.3E-6; DATASHEETURL: http://www.tdk.co.jp/tefe02/e4187%5Fc.pdf; ESR: 0.004035; IRMS: 0.0; MANUFACTURER_PART_NUMBER: C3216X7R1E335K; VDC: 25.0; VENDOR: TDK
C25 = 5v_fixed:GRM1555C1E621JA01D; CAP: 6.2E-10; ESR: 0.0; IRMS: 0.0; MANUFACTURER_PART_NUMBER: GRM1555C1E621JA01D; VDC: 25.0; VENDOR: MuRata
C32 = 3-3_fixed:C0603C104K3RACTU; CAP: 1.0E-7; ESR: 0.0; IRMS: 0.0; MANUFACTURER_PART_NUMBER: C0603C104K3RACTU; VDC: 25.0; VENDOR: Kemet
C33 = 3-3_fixed:08055C391KAT2A; CAP: 3.9E-10; ESR: 0.509; IRMS: 0.0; MANUFACTURER_PART_NUMBER: 08055C391KAT2A; VDC: 50.0; VENDOR: AVX
C37 = SparkFun-Capacitors:100UF-10V-10%(TANT): CAP-07890; PROD_ID: CAP-07890
D1 = diode:DIODE-: DIODE
IN1-IN4 OUT1-OUT4 = SparkFun-Connectors:M03: Header 3 Standard 3-pin 0.1" header. Use with straight break away headers (SKU : PRT-00116), right angle break away headers (PRT-00553), swiss pins (PRT-00743), machine pins (PRT-00117), and female headers (PRT-00115). Molex polarized connector foot print use with SKU : PRT-08232 with associated crimp pins and housings.
J1 J2 = con-lstb:MA10-2: PIN HEADER; OC_FARNELL: unknown; OC_NEWARK: unknown
J12 = jtag_interface:EXTERNAL_DEBUG_CON
L1 L2 = 5v_fixed:IHLP1212BZER2R2M11; DATASHEETURL: http://www.vishay.com/docs/34289/lp12bz11.pdf; DCR: 46.0; DESCRIPTION: Unknown; IDC: 3.0; L: 2.2E-6; MANUFACTURER: Vishay; MANUFACTURER_PART_NUMBER: IHLP1212BZER2R2M11; PACKAGE_DESIGNATOR: IHLP-1212BZ; VENDOR: Vishay-Dale
LIDAR_LASER = SparkFun-Connectors:M04: Header 4 Standard 4-pin 0.1" header. Use with straight break away headers (SKU : PRT-00116), right angle break away headers (PRT-00553), swiss pins (PRT-00743), machine pins (PRT-00117), and female headers (PRT-00115). Molex polarized connector foot print use with SKU : PRT-08231 with associated crimp pins and housings. 1MM SMD Version SKU: PRT-10208
LIDAR_MOTOR = SparkFun-Connectors:M02: Standard 2-pin 0.1" header. Use with - straight break away headers ( PRT-00116) - right angle break away headers (PRT-00553) - swiss pins (PRT-00743) - machine pins (PRT-00117) - female headers (PRT-00115) Molex polarized connector foot print use with: PRT-08233 with associated crimp pins and housings. 2.54_SCREWTERM for use with PRT-10571. 3.5mm Screw Terminal footprints for PRT-08084 5mm Screw Terminal footprints for use with PRT-08432
POWER_IN = con-molex:22-?-02: CONNECTOR wire to board 2.54 mm (.1 inch) pitch header; OC_FARNELL: 9731601; OC_NEWARK: unknown
R1 R2 R5-R29 = rcl:R-US_: RESISTOR, American symbol
R3 R4 = 5v_fixed:CRCW0402100KFKED; MANUFACTURER_PART_NUMBER: CRCW0402100KFKED; POWER: 0.063; RESISTANCE: 100000.0; TOLERANCE: 1.0; VENDOR: Vishay-Dale
RESET = adafruit:EVQQ2: SMT 6mm switch, EVQQ2 series http://www.ladyada.net/library/eagle
SPDT = range_cape:SPDT_SWITCH
U1 U4 = range_cape:SN74CBT3383PW: 10-BIT FET BUS-EXCHANGE SWITCHES; MPN: SN74CBT3383PW; OC_FARNELL: 1741489; OC_NEWARK: 50R6333; PACKAGE: TSSOP-24; SUPPLIER: Texas Instruments
U2 = 5v_fixed:TPS62143RGTR; DATASHEETURL: http://www.ti.com/product/tps62131; FREQUENCY: 2500000.0; IMAX: 3.0; MANUFACTURER_PART_NUMBER: TPS62131RGTR; MKTG_PACKAGE: S-PVQFN-N16; NSID: TPS62131RGTR; PACKAGE: S-PVQFN-N16; VENDOR: Texas Instruments
U3 = 3-3_fixed:TPS62132RGTR; DATASHEETURL: http://www.ti.com/product/tps62131; FREQUENCY: 2500000.0; IMAX: 3.0; MANUFACTURER_PART_NUMBER: TPS62131RGTR; MKTG_PACKAGE: S-PVQFN-N16; NSID: TPS62131RGTR; PACKAGE: S-PVQFN-N16; VENDOR: Texas Instruments
U$1 = SparkFun-Boards:BEAGLE_BONE_BLACK_CAPE
U$3 = range_cape:MSP430FR5969
U$4 = range_cape:DPDT_I2C_SPI
U$5 = range_cape:DRV8837

## Net classes
0 default: width 0.203 mm, drill 0.33 mm, clearance 0.254 mm

## Board
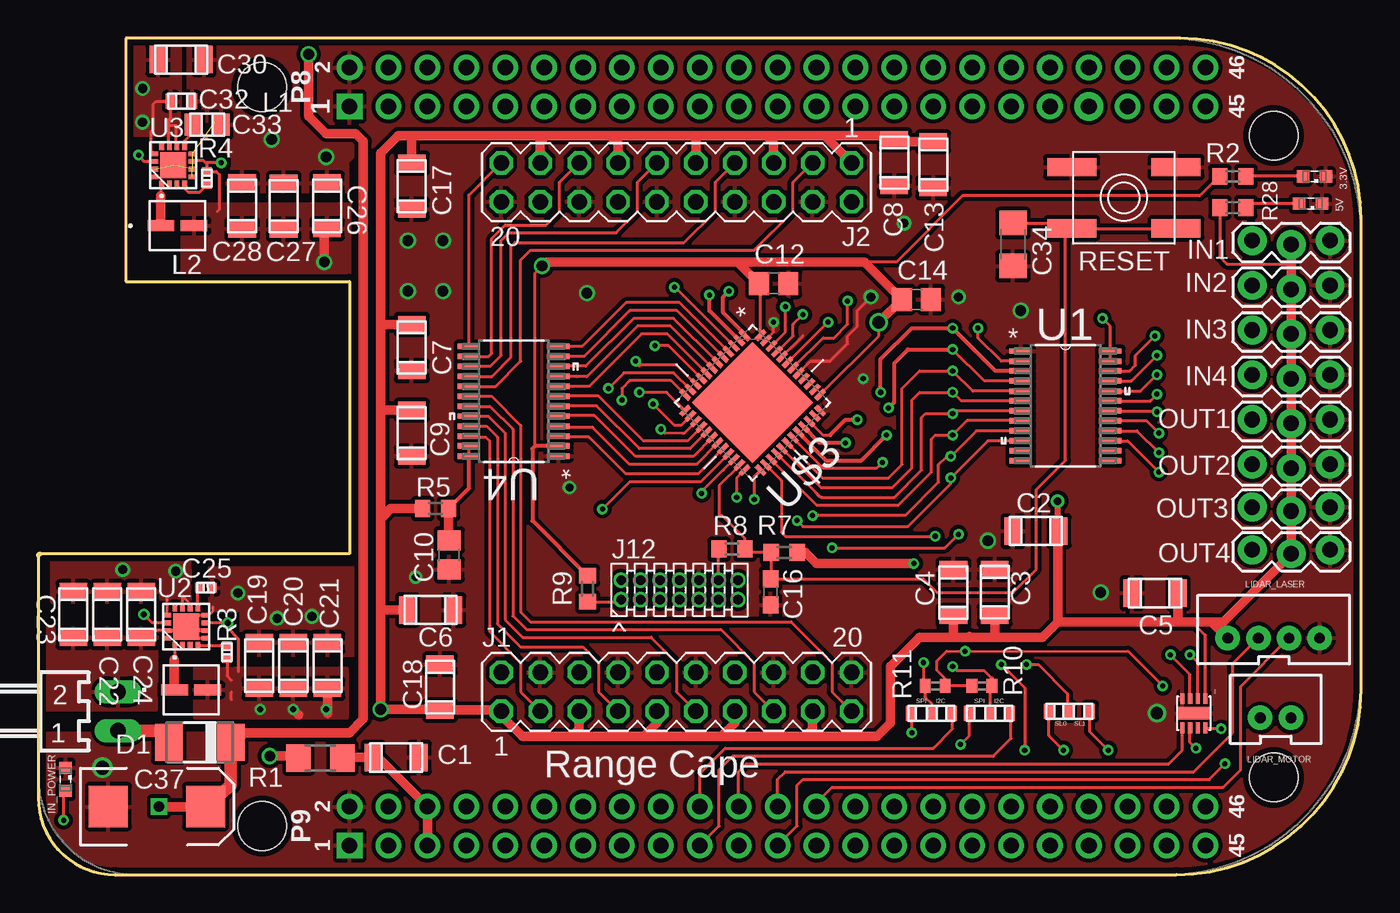
[diagram p5: board, top side]
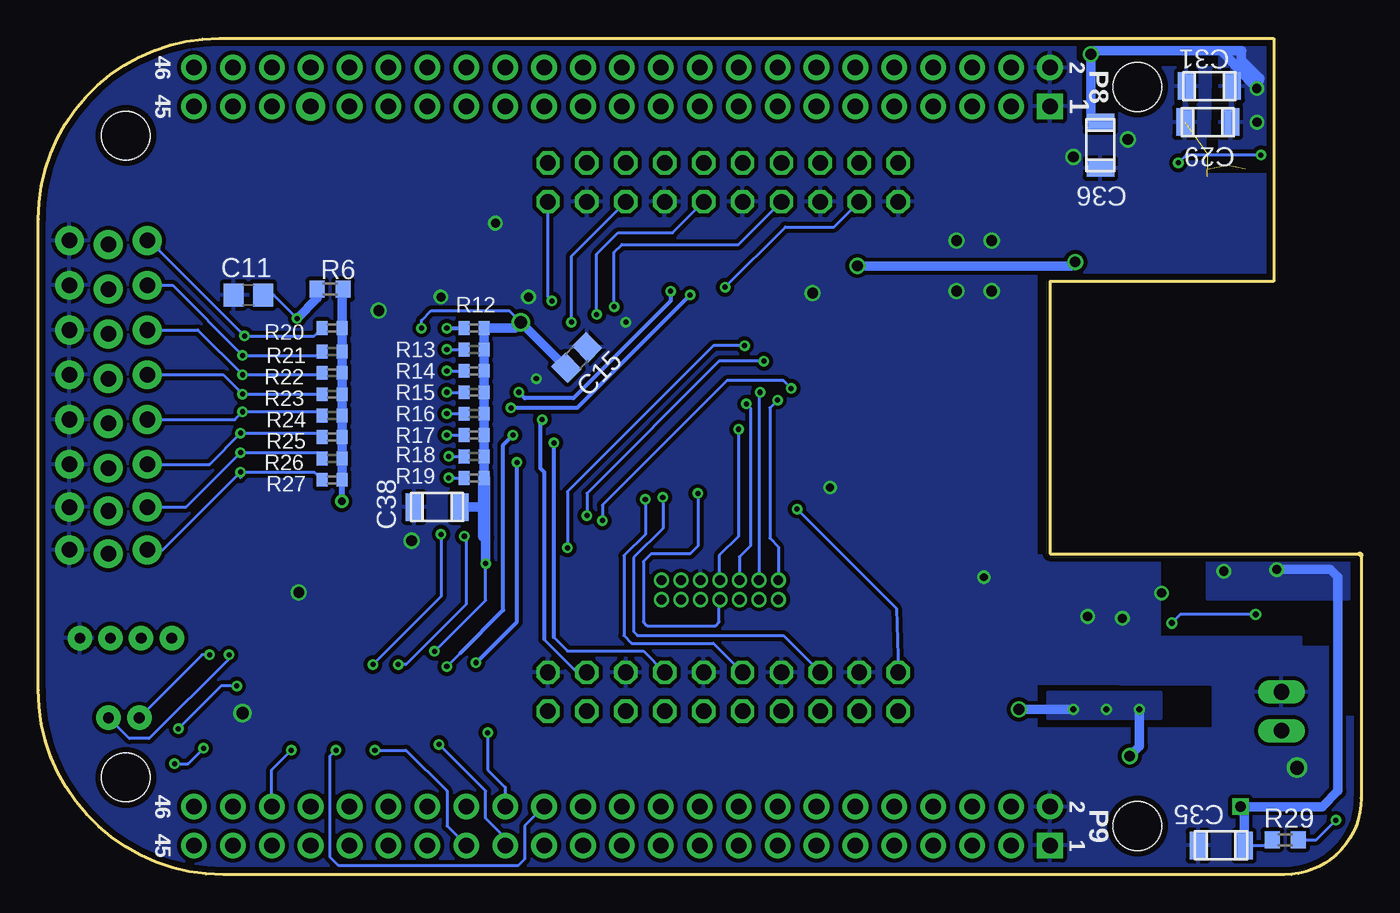
[diagram p6: board, bottom side, seen from below]

Size 86.36 x 54.61 mm. Coordinates in mm from the lower left corner, seen from the top.
Outline: 0,20.83 arc-90 0.13,20.95 20.32,20.95 20.32,38.73 5.72,38.73 5.72,54.61 74.55,54.61 arc-90 86.36,42.8 86.36,12.07 arc-90 74.3,0 5,0 arc-90 0,5 0,20.95
Copper layers (1*16): Top 0.0356mm / dielectric 1.5011mm / Bottom 0.0356mm
Design rules "LaenPCBOrder *": minimum track width 6mil, minimum drill 13mil, track to track 6mil, track to pad 6mil, pad to pad 6mil, via to via 6mil, smd to smd 6mil, copper to edge 15mil, drill to drill 6mil, minimum pad ring 7mil, minimum via ring 7mil, stop-mask expansion 3mil, vias tented up to drill 0mil, thermal gap 10mil

### Footprints (pad centres in the part's own frame; a part is rotated, then mirrored left to right if it is on the bottom)
LED_SML0603 = smd 0.8 x 0.8: A 0.75,0; C -0.75,0
1206 = smd 1.118 x 1.803: 1 -1.499,0; 2 1.499,0
C0805 = smd 1.3 x 1.5: 1 -0.95,0; 2 0.95,0
C0603 = smd 1.1 x 1: 1 -0.85,0; 2 0.85,0
C3216X7R1E335K = smd 1.118 x 1.803: 1 -1.499,0; 2 1.499,0
0402 = smd 0.559 x 0.61: 1 -0.419,0; 2 0.419,0
0603 = smd 0.66 x 0.965: 1 -0.699,0; 2 0.699,0
0805 = smd 1.118 x 1.448: 1 -0.902,0; 2 0.902,0
C1206 = smd 1.6 x 1.8: 1 -1.4,0; 2 1.4,0
EIA7343 = smd 2.55 x 2.7: A 3.17,0; C -3.17,0
DO-214AC = smd 1.8 x 2.4: A 2.025,0; C -2.025,0
1X03_LOCK = drill 1.016 pad 1.88: 1 0,0.127; 2 2.54,-0.127; 3 5.08,0.127
MA10-2 = drill 1.016 octagon: 1 -11.43,-1.27; 2 -11.43,1.27; 3 -8.89,-1.27; 4 -8.89,1.27; 5 -6.35,-1.27; 6 -6.35,1.27; 7 -3.81,-1.27; 8 -3.81,1.27; 9 -1.27,-1.27; 10 -1.27,1.27; 11 1.27,-1.27; 12 1.27,1.27; 13 3.81,-1.27; 14 3.81,1.27; 15 6.35,-1.27; 16 6.35,1.27; 17 8.89,-1.27; 18 8.89,1.27; 19 11.43,-1.27; 20 11.43,1.27
EXTERNAL_DEBUG = drill 0.635 pad 0.737: 1 -2.54,-0.635; 2 -2.54,0.635; 3 -1.27,-0.635; 4 -1.27,0.635; 5 0,-0.635; 6 0,0.635; 7 1.27,-0.635; 9 2.54,-0.635; 10 2.54,0.635; 11 3.81,-0.635; 12 3.81,0.635; 13 5.08,-0.635; 14 5.08,0.635 | drill 0.635 pad 0.762: 8 1.27,0.635
IHLP-1212BZ = smd 1.753 x 0.711: 1 -1.079,0; 2 1.079,0
JST-4-PTH-VERT = drill 0.7 pad 1.6: 1 -3,-0.55; 2 -1,-0.55; 3 1,-0.55; 4 3,-0.55
JST-2-PTH-VERT = drill 0.7 pad 1.6: 1 -1,-0.55; 2 1,-0.55
7395-02 = drill 1.016 long: 1 1.27,0; 2 -1.27,0
R1206 = smd 1.6 x 1.803: 1 -1.422,0; 2 1.422,0
R0603 = smd 1 x 1.1: 1 -0.85,0; 2 0.85,0
CRCW0402100KFKED = smd 0.559 x 0.61: 1 -0.419,0; 2 0.419,0
R0402 = smd 0.7 x 0.9: 1 -0.65,0; 2 0.65,0
EVQ-Q2 = smd 3.2 x 1.2: A -3.4,-2; A' 3.4,-2; B -3.4,2; B' 3.4,2
SPDT = smd 0.66 x 0.965: 1 -0.699,0; 2 0.572,0; 3 1.968,0
SOP65P640X120-24N = smd 1.473 x 0.356: 1 -2.921,3.581; 2 -2.921,2.921; 3 -2.921,2.286; 4 -2.921,1.626; 5 -2.921,0.965; 6 -2.921,0.33; 7 -2.921,-0.33; 8 -2.921,-0.965; 9 -2.921,-1.626; 10 -2.921,-2.286; 11 -2.921,-2.921; 12 -2.921,-3.581; 13 2.921,-3.581; 14 2.921,-2.921; 15 2.921,-2.286; 16 2.921,-1.626; 17 2.921,-0.965; 18 2.921,-0.33; 19 2.921,0.33; 20 2.921,0.965; 21 2.921,1.626; 22 2.921,2.286; 23 2.921,2.921; 24 2.921,3.581
S-PVQFN-N16 = smd 0.508 x 0.305: 1 -1.25,0.75; 2 -1.25,0.25; 3 -1.25,-0.25; 4 -1.25,-0.75; 9 1.25,-0.75; 10 1.25,-0.25; 11 1.25,0.25; 12 1.25,0.75 | smd 0.305 x 0.508: 5 -0.75,-1.25; 6 -0.25,-1.25; 7 0.25,-1.25; 8 0.75,-1.25; 13 0.75,1.25; 14 0.25,1.25; 15 -0.25,1.25; 16 -0.75,1.25 | smd 1.702 x 1.702: 17 0,0
BEAGLE_BONE_BLACK_CAPE = drill 1.016 pad 1.676 square: P8.1 20.32,50.165; P9.1 20.32,1.905 | drill 1.016 pad 1.676: P8.2 20.32,52.705; P8.3 22.86,50.165; P8.4 22.86,52.705; P8.5 25.4,50.165; P8.6 25.4,52.705; P8.7 27.94,50.165; P8.8 27.94,52.705; P8.9 30.48,50.165; P8.10 30.48,52.705; P8.11 33.02,50.165; P8.12 33.02,52.705; P8.13 35.56,50.165; P8.14 35.56,52.705; P8.15 38.1,50.165; P8.16 38.1,52.705; P8.17 40.64,50.165; P8.18 40.64,52.705; P8.19 43.18,50.165; P8.20 43.18,52.705; P8.21 45.72,50.165; P8.22 45.72,52.705; P8.23 48.26,50.165; P8.24 48.26,52.705; P8.25 50.8,50.165; P8.26 50.8,52.705; P8.27 53.34,50.165; P8.28 53.34,52.705; P8.29 55.88,50.165; P8.30 55.88,52.705; P8.31 58.42,50.165; P8.32 58.42,52.705; P8.33 60.96,50.165; P8.34 60.96,52.705; P8.35 63.5,50.165; P8.36 63.5,52.705; P8.37 66.04,50.165; P8.38 66.04,52.705; P8.40 68.58,52.705; P8.41 71.12,50.165; P8.42 71.12,52.705; P8.43 73.66,50.165; P8.44 73.66,52.705; P8.45 76.2,50.165; P8.46 76.2,52.705; P9.2 20.32,4.445; P9.3 22.86,1.905; P9.4 22.86,4.445; P9.5 25.4,1.905; P9.6 25.4,4.445; P9.7 27.94,1.905; P9.8 27.94,4.445; P9.9 30.48,1.905; P9.10 30.48,4.445; P9.11 33.02,1.905; P9.12 33.02,4.445; P9.13 35.56,1.905; P9.14 35.56,4.445; P9.15 38.1,1.905; P9.16 38.1,4.445; P9.17 40.64,1.905; P9.18 40.64,4.445; P9.19 43.18,1.905; P9.20 43.18,4.445; P9.21 45.72,1.905; P9.22 45.72,4.445; P9.23 48.26,1.905; P9.24 48.26,4.445; P9.25 50.8,1.905; P9.26 50.8,4.445; P9.27 53.34,1.905; P9.28 53.34,4.445; P9.29 55.88,1.905; P9.30 55.88,4.445; P9.31 58.42,1.905; P9.32 58.42,4.445; P9.33 60.96,1.905; P9.34 60.96,4.445; P9.35 63.5,1.905; P9.36 63.5,4.445; P9.37 66.04,1.905; P9.38 66.04,4.445; P9.39 68.58,1.905; P9.40 68.58,4.445; P9.41 71.12,1.905; P9.42 71.12,4.445; P9.43 73.66,1.905; P9.44 73.66,4.445; P9.45 76.2,1.905; P9.46 76.2,4.445 | drill 1.016 pad 1.88: P8.39 68.58,50.165 | hole 3.175: 14.605,3.175; 80.645,6.35; 80.645,48.26; 14.605,51.435
QFN50P700X700X100-49N = smd 0.813 x 0.305: 1 -3.48,2.743; 2 -3.48,2.261; 3 -3.48,1.753; 4 -3.48,1.245; 5 -3.48,0.762; 6 -3.48,0.254; 7 -3.48,-0.254; 8 -3.48,-0.762; 9 -3.48,-1.245; 10 -3.48,-1.753; 11 -3.48,-2.261; 12 -3.48,-2.743; 25 3.48,-2.743; 26 3.48,-2.261; 27 3.48,-1.753; 28 3.48,-1.245; 29 3.48,-0.762; 30 3.48,-0.254; 31 3.48,0.254; 32 3.48,0.762; 33 3.48,1.245; 34 3.48,1.753; 35 3.48,2.261; 36 3.48,2.743 | smd 0.305 x 0.813: 13 -2.743,-3.48; 14 -2.261,-3.48; 15 -1.753,-3.48; 16 -1.245,-3.48; 17 -0.762,-3.48; 18 -0.254,-3.48; 19 0.254,-3.48; 20 0.762,-3.48; 21 1.245,-3.48; 22 1.753,-3.48; 23 2.261,-3.48; 24 2.743,-3.48; 37 2.743,3.48; 38 2.261,3.48; 39 1.753,3.48; 40 1.245,3.48; 41 0.762,3.48; 42 0.254,3.48; 43 -0.254,3.48; 44 -0.762,3.48; 45 -1.245,3.48; 46 -1.753,3.48; 47 -2.261,3.48; 48 -2.743,3.48 | smd 5.588 x 5.588: 49 0,0
DPDT = smd 0.66 x 0.965: 1 -0.699,0; 2 0.572,0; 3 1.968,0; 4 3.111,0; 5 4.381,0; 6 5.779,0
WSON-8 = smd 0.27 x 0.7: 1 0.75,0.95; 2 0.25,0.95; 3 -0.25,0.95; 4 -0.75,0.95; 5 -0.75,-0.95; 6 -0.25,-0.95; 7 0.25,-0.95; 8 0.75,-0.95 | smd 2 x 0.8: PPAD 0,0

### Placement (x,y rotation side)
3.3V  83.31,45.59 180 top
5V  83.06,43.82 180 top
C1  23.37,7.65 0 top
C2  65.13,22.43 180 top
C3  62.43,18.44 90 top
C4  59.74,18.41 90 top
C5  72.9,18.38 180 top
C6  25.62,17.28 0 top
C7  24.38,34.42 270 top
C8  55.88,46.48 270 top
C9  24.38,28.83 270 top
C10  26.82,20.88 270 top
C11  72.64,37.85 180 bottom
C12  48.01,38.61 0 top
C13  58.42,46.36 270 top
C14  57.33,37.55 0 top
C15  51.21,33.77 45 bottom
C16  47.8,18.47 270 top
C17  24.38,44.96 270 top
C18  26.22,12.25 90 top
C19  14.43,13.65 90 top
C20  16.65,13.65 90 top
C21  18.88,13.65 90 top
C22  4.51,16.99 270 top
C23  2.29,16.99 270 top
C24  6.73,16.99 270 top
C25  10.94,18.73 0 top
C26  18.85,43.67 90 top
C27  16.02,43.64 90 top
C28  13.31,43.67 90 top
C29  10.02,49.15 180 bottom
C30  9.32,53.22 0 top
C31  9.91,51.5 180 bottom
C32  9.35,50.5 0 top
C33  11.02,48.96 0 top
C34  63.63,41.15 270 top
C35  9.14,1.91 180 bottom
C36  17.02,47.62 270 bottom
C37  7.75,4.45 0 top
C38  60.33,24 180 bottom
D1  10.54,8.64 180 top
IN1  79.25,41.28 0 top
IN2  79.25,38.35 0 top
IN3  79.25,35.43 0 top
IN4  79.25,32.51 0 top
IN_POWER  1.78,6.22 270 top
J1  41.66,11.94 0 top
J2  41.66,45.21 180 top
J12  40.59,18.59 0 top
L1  9.99,12.07 0 top
L2  9.08,42.37 0 top
LIDAR_LASER  80.64,16 0 top
LIDAR_MOTOR  80.77,10.8 0 top
OUT1  79.25,29.59 0 top
OUT2  79.25,26.67 0 top
OUT3  79.25,23.88 0 top
OUT4  79.25,21.08 0 top
POWER_IN  5.21,10.67 270 top
R1  18.42,7.62 180 top
R2  77.98,45.59 180 top
R3  12.32,14.53 90 top
R4  11.02,45.49 270 top
R5  25.93,23.9 180 top
R6  67.31,38.23 0 bottom
R7  48.69,21.03 0 top
R8  45.29,21.26 0 top
R9  35.86,18.67 90 top
R10  61.59,12.32 180 top
R11  58.55,12.32 0 top
R12  57.91,35.69 180 bottom
R13  57.91,34.29 180 bottom
R14  57.91,32.89 180 bottom
R15  57.91,31.5 180 bottom
R16  57.91,30.1 180 bottom
R17  57.91,28.7 180 bottom
R18  57.91,27.3 180 bottom
R19  57.91,25.91 180 bottom
R20  67.18,35.69 0 bottom
R21  67.18,34.16 0 bottom
R22  67.18,32.77 0 bottom
R23  67.18,31.37 0 bottom
R24  67.18,29.97 0 bottom
R25  67.18,28.57 0 bottom
R26  67.18,27.18 0 bottom
R27  67.18,25.78 0 bottom
R28  77.98,43.56 180 top
R29  4.95,2.29 180 bottom
RESET  70.87,44.2 180 top
SPDT  66.67,10.67 0 top
U1  67.06,30.61 0 top
U2  9.67,16.19 90 top
U3  8.81,46.32 90 top
U4  31.04,30.91 180 top
U$1  0,0 0 top
U$3  46.63,30.81 315 top
U$4  62.74,10.54 180 top
U$5  75.44,10.54 0 top

### Tracks (layer width: path | path; a pad name or v marks a point on that pad's centre or on a via)
+3V3  (via drill 0.33, 0.7, 0.8)
  Top 0.203: R10.2 R11.2 59.2,12.81 58.67,13.34 58.67,13.97 59.31,14.61 v60.5,14.58 71.12,14.61 v73.41,12.32 | U$3.48 47.15,38.51 C12.1 | U$3.37 54.86,35.18 v54.86,36.07 | 10.92,46.48 11.02,46.39 R4.1 11.63,45.9 11.81,45.72 11.81,43.43 11.68,43.31 | 10.92,46.48 10.8,46.61 10.1,46.61 U3.7 | v11.94,46.48 10.92,46.48 | U3.14 6.9,46.57 v6.54,46.99 | 32.44,27.99 32.44,39.29 v32.89,39.75 | U1.2 62.87,33.53 61.34,35.05 v61.34,35.69 | 76.2,9.58 U$5.8 76.25,9.52 v77.22,9.52 | R2.2 77.09,45.59 75.82,44.32 60.33,44.32 56.01,40.01 53.93,40.01 | 56.64,37.82 C14.1
  Top 0.254: U4.2 32.44,27.99 32.26,27.81 32.26,23.13 R9.2
  Top 0.61: 45.66,40.01 53.93,40.01 C14.1 54.89,36.07 v54.86,36.07 | C12.1 45.66,40.01 | v18.67,40.01 18.67,41.99 C26.1 | 45.66,40.01 33.15,40.01 v32.89,39.75 | R7.2 50.09,21.03 50.8,20.32 v57.15,20.32
  Bottom 0.203: v60.5,14.58 57.15,17.91 v57.15,20.32 | v6.54,46.99 11.43,46.99 v11.94,46.48 | v61.34,35.69 61.34,36.2 60.71,36.83 55.63,36.83 v54.86,36.07 | v73.41,12.32 74.42,12.32 v77.22,9.52
  Bottom 0.61: R19.1 R18.1 R17.1 R16.1 R15.1 R14.1 R13.1 R12.1 55.25,35.69 v54.86,36.07 51.89,33.1 C15.1 | v32.89,39.75 18.92,39.75 v18.67,40.01 | v57.15,20.32 57.15,22 57.26,22.11 | C38.1 57.39,24 57.26,23.88
  Bottom 0.813: 57.26,22.11 57.26,23.88 R19.1
  pour Top: 20.32,39.12 9.4,39.12 9.4,43.82 20.32,43.82
+5V  (via drill 0.38, 0.51, 0.7)
  Top 0.203: U2.7 10.93,16.43 v12.37,16.43 12.37,16.19 13.06,15.4 13.06,13.26 | 12.61,11.43 12.61,11.91 | U2.14 7.43,16.44 v6.89,16.99 | R3.1 12.32,12.98 12.61,12.7 | 71.23,16.39 71.12,16.51 | U$5.1 76.19,15.63 75.31,16.51 | R28.2 77.13,40.35 77.6,39.88 81.66,39.88 81.79,39.75
  Top 0.406: OUT4.2 81.55,20.72 | C2.1 66.55,22.48 v66.55,24.38 | R1.2 16.87,7.75
  Top 0.61: 34.8,9.02 31.62,9.02 30.23,10.41 J1.1 30.15,10.75 C18.1 26.17,10.8 v22.35,10.8 22.35,17.28 | 34.8,9.02 39.5,9.02 | 39.5,9.02 44.58,9.02 | J1.13 45.47,9.91 44.58,9.02 | J1.9 40.39,9.91 39.5,9.02 | J1.5 35.31,9.52 34.8,9.02 | 44.58,9.02 50.04,9.02 | 50.04,9.02 54.74,9.02 55.63,9.91 55.63,13.59 57.53,15.49 59.94,15.49 | 59.94,15.49 60.71,15.49 | 60.71,15.49 62.48,15.49 | 62.48,15.49 65.53,15.49 66.55,16.51 | J1.17 50.55,9.52 50.04,9.02 | 66.55,16.51 66.55,22.33 C2.1 | 66.55,16.51 71.12,16.51 74.3,16.51 | 74.3,16.51 75.31,16.51 76.58,16.51 | C21.1 18.88,10.54 | 60.78,15.57 60.71,15.49 | J2.17 32.77,47.88 33.15,48.26 | 33.15,48.26 37.34,48.26 | 37.34,48.26 42.67,48.26 | 42.67,48.26 47.5,48.26 | 47.5,48.26 51.31,48.26 | 51.31,48.26 J2.1 | J2.5 48.01,47.75 47.5,48.26 | J2.9 42.93,48.01 42.67,48.26 | J2.13 37.85,47.75 37.34,48.26 | 33.15,48.26 24.38,48.26 | 24.38,48.26 23.5,48.26 22.35,47.12 22.35,36.07 | 22.35,36.07 22.35,30.23 | 22.35,30.23 22.35,23.24 | 22.35,23.24 22.35,17.28 | v16.64,10.8 16.99,10.44 | R5.2 23.01,23.9 22.35,23.24 | C9.1 22.45,30.33 22.35,30.23 | C7.1 22.5,35.92 22.35,36.07 | C17.1 24.38,48.26 | C5.1 74.39,16.6 74.3,16.51 | LIDAR_LASER.1 76.58,16.51 | 76.58,16.51 77.34,16.51 OUT4.2 OUT3.2 OUT2.2 OUT1.2 IN4.2 IN3.2 IN2.2 81.79,39.75 IN1.2 | 51.31,48.26 55.6,48.26 C8.1 55.88,47.85 C13.1 | 16.87,7.75 v15.11,7.75 | C6.1 22.35,17.28 | C4.1 59.74,15.7 59.94,15.49 | C3.1 62.43,15.54 62.48,15.49
  Bottom 0.203: v6.89,16.99 11.81,16.99 v12.37,16.43
  Bottom 0.406: v66.55,24.38 66.53,24.4 R27.2
  Bottom 0.61: R6.2 66.53,38.15 R20.2 R21.2 R22.2 R23.2 R24.2 R25.2 R26.2 R27.2 | v22.35,10.8 18.88,10.8 | v15.11,7.75 14.48,8.38 v14.48,10.8
  other vias: 18.8,10.8
  pour Top: 10.22,13.49 20.15,13.49 20.15,10.19 10.22,10.19
  pour Bottom: 20.45,11.94 13.08,11.94 13.08,10.16 20.45,10.16
ECHO_1
  Top 0.203: U4.22 28.17,28.57 29.21,28.57 29.46,28.32 29.46,15.88 31.5,13.84 31.5,11.94 J1.3
ECHO_2
  Top 0.203: U4.21 29.26,29.29 29.97,28.57 29.97,16.38 31.5,14.86 35.56,14.86 36.58,13.84 36.58,11.94 J1.7
ECHO_3
  Top 0.203: U4.20 29.36,29.95 30.48,28.83 30.48,16.64 31.62,15.49 40.01,15.49 41.66,13.84 41.66,11.94 J1.11
ECHO_4
  Top 0.203: U4.19 29.49,30.58 30.99,29.08 30.99,16.89 31.88,16 44.58,16 46.74,13.84 46.74,11.94 J1.15
ECHO_5
  Top 0.203: U4.18 29.59,31.24 31.5,29.34 31.5,17.14 32.13,16.51 49.15,16.51 51.82,13.84 51.82,11.94 J1.19
ECHO_6
  Top 0.203: U4.17 29.84,31.88 31.5,33.53 31.5,40.13 32.13,40.77 46.74,40.77 49.28,43.31 49.28,45.21 J2.3
ECHO_7
  Top 0.203: U4.16 29.62,32.54 30.86,33.78 30.86,41.02 31.12,41.28 42.16,41.28 44.2,43.31 44.2,45.21 J2.7
ECHO_8
  Top 0.203: U4.15 29.52,33.2 30.23,33.91 30.23,41.4 30.73,41.91 37.72,41.91 39.12,43.31 39.12,45.21 J2.11
ECHO_9
  Top 0.203: U4.14 29.39,33.83 29.59,34.04 29.59,41.53 30.48,42.42 33.15,42.42 34.04,43.31 34.04,45.21 J2.15
ECHO_10
  Top 0.203: U4.13 28.12,44.37 J2.19
GND  (via drill 0.33, 0.51, 0.6, 0.7, 0.8, 0.9)  (5 unrouted)
  Top 0.203: U2.17 10.3,16.83 10.3,16.91 10.34,16.94 U2.8 11.13,16.94 11.41,17.22 11.41,17.46 | 10.14,15.95 10.07,15.88 10.07,15.48 10.1,15.44 U2.5 | U2.15 7.19,15.94 C24.2 | U$3.47 47.49,34.92 48.01,35.43 v48.01,36.07 | U$3.44 49.91,35.18 | U$3.41 50.42,33.53 51.69,33.53 52.83,34.67 52.83,35.18 53.47,35.81 53.47,36.83 v54.36,37.72
  Top 0.254: U2.15 8.95,15.94 | 8.95,15.94 8.95,15.95 | U2.6 10.14,15.94 10.14,15.95 9.67,15.95 U2.17 9.67,15.94 8.95,15.94
  other vias: 13.03,18.39 15.6,16.74 17.86,16.87 53.85,32.39 34.67,25.27 35.81,37.97 15.24,48.01 18.8,46.86 24.13,38.1 26.42,38.1 26.42,41.4 24.13,41.4 64.14,36.83 73.03,10.54 60.07,37.72 24.64,19.43 56.52,42.55 4.19,6.99 61.99,21.81 69.35,18.43
  pour Top: -0.33,16.11 7.76,16.11 7.68,10.72 -0.41,10.72
  pour Top (isolate 0.254): 20.78,14.29 13.24,14.29 13.24,17.22 11.18,17.22 11.18,20.07 20.78,20.07
  pour Bottom (isolate 0.254): 3.94,12.34 21.67,12.47 21.67,20.88 13.18,20.75 13.18,15.52 3.94,15.52
  pour Top: 9.78,54.61 21.46,54.61 21.46,47.75 20.19,46.48 20.19,44.58 12.32,44.58 12.32,45.85 12.7,46.23 12.7,46.74 12.32,47.12 12.32,49.15 9.78,49.15
  pour Bottom: 9.78,52.71 18.16,52.71 18.67,53.21 18.67,54.36 21.59,54.36 21.72,54.23 21.72,39.12 21.84,38.99 6.1,38.99 6.1,45.72 10.16,45.72 10.16,48.26 9.87,48.23 9.82,52.48
  pour Bottom (isolate 0.254): 0,10.29 7.75,10.29 7.75,9.52 21.21,9.52 21.21,11.43 21.21,26.04 21.21,48.51 21.21,55.25 86.87,55.25 86.87,43.82 86.87,-0.25 0.38,-0.25 0,-0.25 0,10.16
  pour Bottom: -0.13,14.48 -0.13,8.25 9.65,8.25 9.65,14.86 -0.13,14.86
  pour Top (isolate 0.254): 86.99,-0.38 0,-0.38 0,9.27 20.95,9.27 20.95,55.5 86.99,55.5
LDS_RX
  Top 0.203: U$1.P9.24 48.26,6.22 48.77,6.73 75.44,6.73 77.98,9.27 77.98,13.79 LIDAR_LASER.2
LDS_TX
  Top 0.203: U$1.P9.26 50.8,4.7 51.82,5.72 77.34,5.72 78.49,6.86 78.49,12.29 LIDAR_LASER.3
LIDAR_DIR  (via drill 0.33)
  Top 0.203: U$1.P9.23 49.53,3.17 49.53,5.84 49.91,6.22 76.45,6.22 v77.47,7.24 | v75.56,8.25 75.18,8.64 U$5.6
  Bottom 0.203: v77.47,7.24 76.58,7.24 v75.56,8.25
LIDAR_OUT1  (via drill 0.33)
  Top 0.203: U$5.2 75.69,13.85 v75.18,14.35
  Bottom 0.203: v75.18,14.35 75.67,14.35 LIDAR_MOTOR.1
LIDAR_OUT2  (via drill 0.33)
  Top 0.203: U$5.3 75.19,13.08 v73.91,14.35
  Bottom 0.203: v73.91,14.35 73.91,14.1 79.12,8.89 80.42,8.89 LIDAR_MOTOR.2
LIDAR_PWM
  Top 0.203: U$1.P9.22 45.72,6.73 46.23,7.24 73.79,7.24 74.68,8.13 74.68,9.58 U$5.5
MCU_ECHO1
  Top 0.203: U$3.20 43.05,26.16 38.35,26.16 35.94,28.57 34.01,28.57 U4.3
MCU_ECHO2
  Top 0.203: U4.4 34.04,29.21 36.2,29.21 38.61,26.8 42.97,26.8 U$3.19
MCU_ECHO3
  Top 0.203: U4.5 33.98,29.97 36.32,29.97 38.99,27.3 42.76,27.3 U$3.18
MCU_ECHO4
  Top 0.203: U$3.17 42.55,27.81 39.24,27.81 36.45,30.61 33.98,30.61 U4.6
MCU_ECHO5
  Top 0.203: U4.7 36.58,31.24 39.5,28.32 42.38,28.32 U$3.16
MCU_ECHO6
  Top 0.203: U$3.8 41.06,35.31 39.37,35.31 35.94,31.88 U4.8
MCU_ECHO7
  Top 0.203: U$3.7 41.27,35.81 39.12,35.81 35.81,32.51 35.18,32.51 35.15,32.54 U4.9
MCU_ECHO8
  Top 0.203: U$3.6 41.48,36.32 38.86,36.32 35.74,33.2 U4.10
MCU_ECHO9
  Top 0.203: U$3.5 41.69,36.83 38.61,36.83 35.61,33.83 U4.11
MCU_ECHO10
  Top 0.203: U$3.4 41.87,37.34 38.35,37.34 35.51,34.49 U4.12
N$1
  Top 0.61: R1.1 19.86,7.65 C1.1 22.2,7.65 U$1.P9.6 U$1.P9.5
N$2
  Top 0.203: U3.1 8,45.01 8,44.32
  Top 0.61: 8,44.32 L2.1
N$3
  Top 0.813: POWER_IN.1 7.75,9.4 D1.A
N$4  (via drill 0.33)
  Top 0.203: v69.47,36.32 69.98,35.81 U1.24 U1.23
  Bottom 0.203: C11.1 70.99,37.85 v69.47,36.32
  Bottom 0.61: R6.1 68.16,37.63 v69.47,36.32
N$5
  Top 0.203: U2.1 8.92,14.09 8.87,14.05
  Top 0.61: 8.87,14.05 8.87,12.73 L1.1
N$6
  Top 0.203: 3.3V.A R2.1
N$7
  Top 0.203: U2.9 10.42,18.63 C25.1
N$8
  Top 0.203: J12.12 44.4,21.73 R8.1
N$9
  Top 0.203: R9.1 37.91,17.82 J12.1
N$10
  Top 0.203: 5V.A 79.08,43.82 R28.1
N$11  (via drill 0.33)
  Top 0.203: v1.65,3.56 1.65,5.73 IN_POWER.A
  Bottom 0.203: R29.1 2.92,2.29 v1.65,3.56
N$12
  Top 0.203: U4.24 U4.23
  Top 0.254: R5.1 28.12,25.24 U4.24
  Top 0.61: C10.1 26.78,21.93 R5.1
N$14
  Top 0.203: R3.2 U2.4
N$15
  Top 0.203: U3.4 9.56,44.8 9.78,44.58 10.53,44.58 R4.2
N$20
  Top 0.203: U3.9 9.56,47.91 10.12,48.47 C33.1 11.08,48.01
PWM_C1  (via drill 0.33)
  Top 0.254: U1.3 62.48,32.89 v59.69,35.69 57.02,35.69 54.99,33.66 v54.99,31.5 | U$3.1 46.11,35.3 44.7,36.7 44.7,37.72 v45.09,38.1
  Bottom 0.254: v59.69,35.69 R12.2 | v45.09,38.1 45.09,37.47 51.44,31.11 54.61,31.11 v54.99,31.5
PWM_C2  (via drill 0.33)
  Top 0.203: U1.4 61.75,32.23 v59.69,34.29
  Top 0.254: U$3.2 43.81,36.83 v43.81,37.85 | v55.5,30.48 55.88,30.86 55.88,33.4 56.77,34.29 v59.69,34.29
  Bottom 0.203: v59.69,34.29 R13.2
  Bottom 0.254: v43.81,37.85 51.18,30.48 v55.5,30.48
PWM_C3  (via drill 0.33)
  Top 0.203: U1.5 61.01,31.57 v59.69,32.89 57.53,32.89 56.39,31.75 56.39,26.8 55.5,25.91 51.18,25.91 U$3.30
  Bottom 0.203: v59.69,32.89 R14.2
PWM_C4  (via drill 0.33)
  Top 0.203: U1.6 60.25,30.94 v59.69,31.5 57.53,31.5 57.02,30.99 57.02,26.54 55.75,25.27 51.09,25.27 U$3.29
  Bottom 0.203: v59.69,31.5 R15.2
PWM_C5  (via drill 0.33)
  Top 0.203: U1.7 59.87,30.28 v59.69,30.1 | 59.61,30.18 v59.69,30.1 | U$3.28 50.75,24.94 50.96,24.73 arc45 51.18,24.64 55.88,24.64 57.66,26.42 57.66,29.85 57.91,30.1 v59.69,30.1
  Bottom 0.203: v59.69,30.1 R16.2
PWM_C6  (via drill 0.33)
  Top 0.203: U1.8 60.63,29.64 v59.69,28.7 R17.2 58.29,28.43 58.29,26.29 56.13,24.13 50.8,24.13 47.85,27.08 U$3.27
  Bottom 0.203: v59.69,28.7 R17.2
PWM_C7  (via drill 0.33)
  Top 0.203: U1.9 61.24,28.98 v59.56,27.3 59.31,27.3 58.78,26.77 58.78,25.63 56.64,23.5 50.67,23.5 arc45 v50.55,23.44 | U$3.10 42.89,32.04 41.66,33.27 39.24,33.27
  Top 0.254: 39.24,33.27 v38.99,33.53
  Bottom 0.203: v59.56,27.3 R18.2 | v50.55,23.44 50.55,24.89 41.91,33.53 v38.99,33.53
PWM_C8  (via drill 0.33)
  Top 0.203: U1.10 61.98,28.32 v59.56,25.91 59.56,25.53 56.77,22.73 49.91,22.73 v49.53,23.11 | U$3.11 41.48,32.77 38.23,32.77 v37.21,31.75
  Bottom 0.203: v59.56,25.91 R19.2 | v49.53,23.11 49.53,24.13 41.4,32.26 37.72,32.26 v37.21,31.75
PWM_IN_1  (via drill 0.33)
  Top 0.203: U1.22 71.25,32.89 71.63,33.27 71.63,33.91 v72.9,35.18
  Bottom 0.203: R20.1 68.34,35.18 v72.9,35.18 78.49,40.77 78.49,41.4 IN1.1
PWM_IN_2  (via drill 0.33)
  Top 0.203: U1.21 71.35,32.23 v73.03,33.91
  Bottom 0.203: R21.1 68.09,33.91 v73.03,33.91 77.6,38.48 IN2.1
PWM_IN_3  (via drill 0.33)
  Top 0.203: U1.20 71.96,31.57 v73.03,32.64
  Bottom 0.203: R22.1 67.96,32.64 v73.03,32.64 75.95,35.56 IN3.1
PWM_IN_4  (via drill 0.33)
  Top 0.203: U1.19 72.59,30.94 v73.03,31.37
  Bottom 0.203: v73.03,31.37 R23.1 | v73.03,31.37 73.28,31.62 | IN4.1 74.3,32.64 v73.03,31.37
PWM_OUT_1  (via drill 0.33)
  Top 0.203: U1.18 72.97,30.28 v73.03,30.23
  Bottom 0.203: R24.1 68.09,30.23 v73.03,30.23 73.53,29.72 OUT1.1
PWM_OUT_2  (via drill 0.33)
  Top 0.203: U1.17 72.34,29.64 v73.15,28.83
  Bottom 0.203: R25.1 68.09,28.83 v73.15,28.83 75.18,26.8 OUT2.1
PWM_OUT_3  (via drill 0.33)
  Top 0.203: U1.16 71.73,28.98 v73.15,27.56
  Bottom 0.203: R26.1 68.21,27.56 v73.15,27.56 76.71,24 OUT3.1
PWM_OUT_4  (via drill 0.33)
  Top 0.203: U1.15 71.12,28.32 v73.15,26.29
  Bottom 0.203: v73.15,26.29 68.34,26.29 R27.1 | v73.15,26.29 73.15,25.91 | OUT4.1 78.23,21.21 v73.15,26.29
RESET
  Top 0.203: U$3.23 45.77,26.72 44.45,25.4 44.45,23.46 44.62,23.46 46.1,21.97 46.1,21.3 R8.2 46.37,21.03 R7.1 47.84,19.36 C16.1 57.77,19.32 58.67,18.41 63.63,18.41 65.15,19.94 65.15,25.15 67.06,27.05 67.06,41.79 | 67.06,41.79 RESET.B' RESET.B | C34.1 66.3,42.54 67.06,41.79
SCL
  Top 0.203: U$1.P9.19 44.45,3.17 44.45,6.86 45.34,7.75 62.36,7.75 63.5,8.89 63.5,10.48 U$4.1
SDA
  Top 0.203: U$1.P9.20 43.18,6.6 44.83,8.25 58.42,8.25 59.69,9.52 59.69,10.48 U$4.4
SIMO  (via drill 0.33)
  Top 0.203: v57.02,9.27 57.02,10.48 U$4.6
  Bottom 0.203: v57.02,9.27 57.02,6.86 55.88,5.72 U$1.P9.30
SIMO/SDA  (via drill 0.33)
  Top 0.203: U$3.31 49.32,28.53 arc45 49.37,28.4 51.23,26.54 54.74,26.54 v55.12,26.92 | v57.78,13.84 57.78,12.43 R11.1 57.91,12.3 57.91,11.56 58.36,11.11 U$4.5
  Bottom 0.254: v57.78,13.84 55.12,16.51 v55.12,26.92
SOMI  (via drill 0.33)
  Top 0.203: v60.2,8.51 60.77,9.08 U$4.3
  Bottom 0.203: U$1.P9.29 55.88,2.41 57.15,3.68 57.15,5.46 v60.2,8.51
SOMI/SCL  (via drill 0.33)
  Top 0.203: v59.69,13.59 59.94,13.34 61.74,13.34 62.25,12.83 | U$4.2 62.17,12.24 R10.1
  Top 0.254: U$3.32 49.63,28.86 51.44,27.05 53.72,27.05 v55.37,28.7 | 62.25,12.83 R10.1
  Bottom 0.203: 58.8,14.48 v59.69,13.59
  Bottom 0.254: v55.37,28.7 56.01,28.07 56.01,17.27 58.8,14.48
SPI_CLK  (via drill 0.33)
  Top 0.203: U$3.26 48.51,25.73 48.51,22.35 48.77,22.1 v58.55,22.1 | v62.87,13.72 64.39,12.19 v64.39,8.13
  Bottom 0.203: v58.55,22.1 58.42,21.97 58.42,17.65 62.36,13.72 v62.87,13.72 | v64.39,8.13 62.36,8.13 59.69,5.46 59.69,3.17 U$1.P9.31
SPI_SL  (via drill 0.33)
  Top 0.203: U$3.9 41.14,34.54 v40.26,34.54 | v51.82,21.34 59.18,21.34 v60.07,22.22 | v64.52,13.72 65.28,13.72 67.18,11.81 67.18,10.73 SPDT.2
  Bottom 0.203: v40.26,34.54 42.29,34.54 51.82,25.02 v51.82,21.34 | v60.07,22.22 60.07,18.16 v64.52,13.72
SPI_SL0  (via drill 0.33)
  Top 0.203: v66.93,8.13 65.98,9.08 SPDT.1
  Bottom 0.203: U$1.P9.28 54.61,3.17 54.61,1.02 55.04,0.58 66.75,0.58 67.31,1.14 67.31,7.75 v66.93,8.13
SPI_SL1  (via drill 0.33)
  Top 0.203: v69.85,8.13 68.64,9.33 SPDT.3
  Bottom 0.203: U$1.P9.42 71.12,6.86 v69.85,8.13
TCK  (via drill 0.33)
  Top 0.203: v40.64,29.08 40.89,28.83 42.04,28.82 42.15,28.82 U$3.15
  Bottom 0.203: J12.8 41.91,19.28 41.91,20.83 40.64,22.1 v40.64,29.08
TDI  (via drill 0.33)
  Top 0.203: U$3.13 41.02,31.5 v39.24,31.5
  Bottom 0.203: J12.4 39.32,31.42 v39.24,31.5
TDO  (via drill 0.33)
  Top 0.203: 42.23,31.43 U$3.12 41.31,32.26 38.61,32.26 38.1,31.75 v38.1,30.99
  Bottom 0.203: v38.1,30.99 38.61,30.48 38.61,21.97 38.05,21.41 J12.2
TEST  (via drill 0.33)
  Top 0.203: U$3.22 44.71,26.42 arc-45 44.7,26.42 43.4,25.11 arc45 v43.31,24.89
  Bottom 0.203: v43.31,24.89 43.31,21.46 43.81,20.95 46.36,20.95 46.86,20.45 46.86,16.51 46.61,16.26 42.16,16.26 41.91,16.51 41.91,17.91 J12.7
TMS  (via drill 0.33)
  Top 0.203: U$3.14 41.95,29.34 41.53,29.34 v40.13,30.73
  Bottom 0.203: v40.13,30.73 39.88,30.48 39.88,21.46 40.59,20.75 J12.6
TRIG_1  (via drill 0.33)
  Top 0.203: v36.83,23.88 38.61,25.65 43.05,25.64 43.22,25.64 U$3.21
  Bottom 0.203: v36.83,23.88 30.35,17.4 J1.2
TRIG_2  (via drill 0.33)
  Top 0.203: U$3.24 45.59,25.9 v45.59,24.64
  Bottom 0.203: v45.59,24.64 45.59,22.61 47.5,20.7 47.5,15.88 47.24,15.62 37.72,15.62 J1.6
TRIG_3  (via drill 0.33)
  Top 0.203: U$3.25 46.74,26 v46.74,24.51
  Bottom 0.203: v46.74,24.51 46.74,22.22 48.13,20.83 48.13,15.62 47.62,15.11 42.29,15.11 J1.10
TRIG_4  (via drill 0.33)
  Top 0.254: v52.7,28.19 51.01,28.19 U$3.33
  Bottom 0.203: 52.7,15.49 51.82,14.61 46.86,14.61 J1.14
  Bottom 0.254: 52.7,15.49 v52.7,28.19
TRIG_5  (via drill 0.33)
  Top 0.203: U$3.34 50.33,29.55 50.52,29.36 50.57,29.36 51.23,28.7 51.69,28.7
  Top 0.254: 51.69,28.7 52.7,29.72 v53.47,29.72
  Bottom 0.203: 53.34,15.37 51.18,13.21 J1.18
  Bottom 0.254: v53.47,29.72 53.59,29.59 53.59,26.54 53.34,26.29 53.34,15.37
TRIG_6  (via drill 0.33)
  Top 0.203: 49.35,33.1 U$3.42 51.23,35.05 51.94,35.05 52.83,35.94 v52.83,37.47
  Bottom 0.203: v52.83,37.47 53.09,37.72 J2.2
TRIG_7  (via drill 0.33)
  Top 0.203: U$3.43 48.95,33.46 v51.56,36.07
  Bottom 0.203: v51.56,36.07 51.56,40.39 J2.6
TRIG_8  (via drill 0.33)
  Top 0.203: U$3.45 48.25,34.16 49.28,35.18 49.28,35.94 v49.91,36.58
  Bottom 0.203: v49.91,36.58 49.91,40.51 48.51,41.91 44.96,41.91 J2.10
TRIG_9  (via drill 0.33)
  Top 0.203: U$3.46 48.77,35.43 v48.77,37.08
  Bottom 0.203: v48.77,37.08 48.77,40.64 48.26,41.15 40.64,41.15 J2.14
TRIG_10  (via drill 0.33)
  Top 0.203: U$3.3 45.37,34.52 45.37,34.54 41.55,38.35 v41.53,38.35
  Bottom 0.203: v41.53,38.35 37.59,42.29 34.42,42.29 J2.18
VCC  (via drill 0.6, 0.7)
  Top 0.203: 8.4,16.96 U2.13 | 8.3,17.06 U2.13 | U2.11 9.42,18.16 9.43,18.18 9.92,17.69 U2.10 | U2.13 8.42,18.12 8.48,18.18 | U3.11 8.51,47.62 8.51,48.9 | 8.51,48.9 8.51,49.28 8.66,49.42 C32.1 7.7,50.5 7.49,50.29 7.49,48.64 7.37,48.51 7.37,47.26 U3.13 | U3.10 9.02,47.61 9.02,48.9 8.51,48.9
  Top 0.254: U2.11
  Top 0.61: D1.C 12.83,8.64 13.46,9.27 20.32,9.27 21.21,10.16 21.21,47.88 20.7,48.39 18.8,48.39 17.65,49.53 v17.65,53.57 | C37.A v7.87,4.45
  Top 0.813: D1.C 12.57,5.84 C37.A
  Bottom 0.203: C35.1 6.18,1.91 R29.2
  Bottom 0.61: 9.02,53.72 8.89,53.58 v6.81,51.33 6.6,51.99 C30.1 7.83,53.78 7.81,53.8 15.85,53.8 15.86,53.81 17.41,53.81 v17.65,53.57 17.65,49.12 C36.1 | v5.51,19.92 5.5,19.94 2.03,19.94 1.52,19.43 1.52,5.46 2.54,4.45 v7.87,4.45 7.65,4.22 C35.1
  other vias: 8.97,19.82 6.79,49.14
  pour Top: 0.86,17.78 7.37,17.78 7.37,18.02 9.99,18.02 9.91,20.64 0.86,20.64
  pour Bottom: 10.06,18.02 0.78,18.02 0.78,20.56 10.06,20.56
  pour Top: 5.72,54.61 9.27,54.61 9.27,48.39 9.27,48.26 5.72,48.26
  pour Bottom: 5.72,54.61 9.27,54.61 9.27,46.86 5.72,46.86

### Text on the board
tPlace: Range Cape